# Altium project ANTS-PCU-B1.PrjPcb (part 1 of 2)
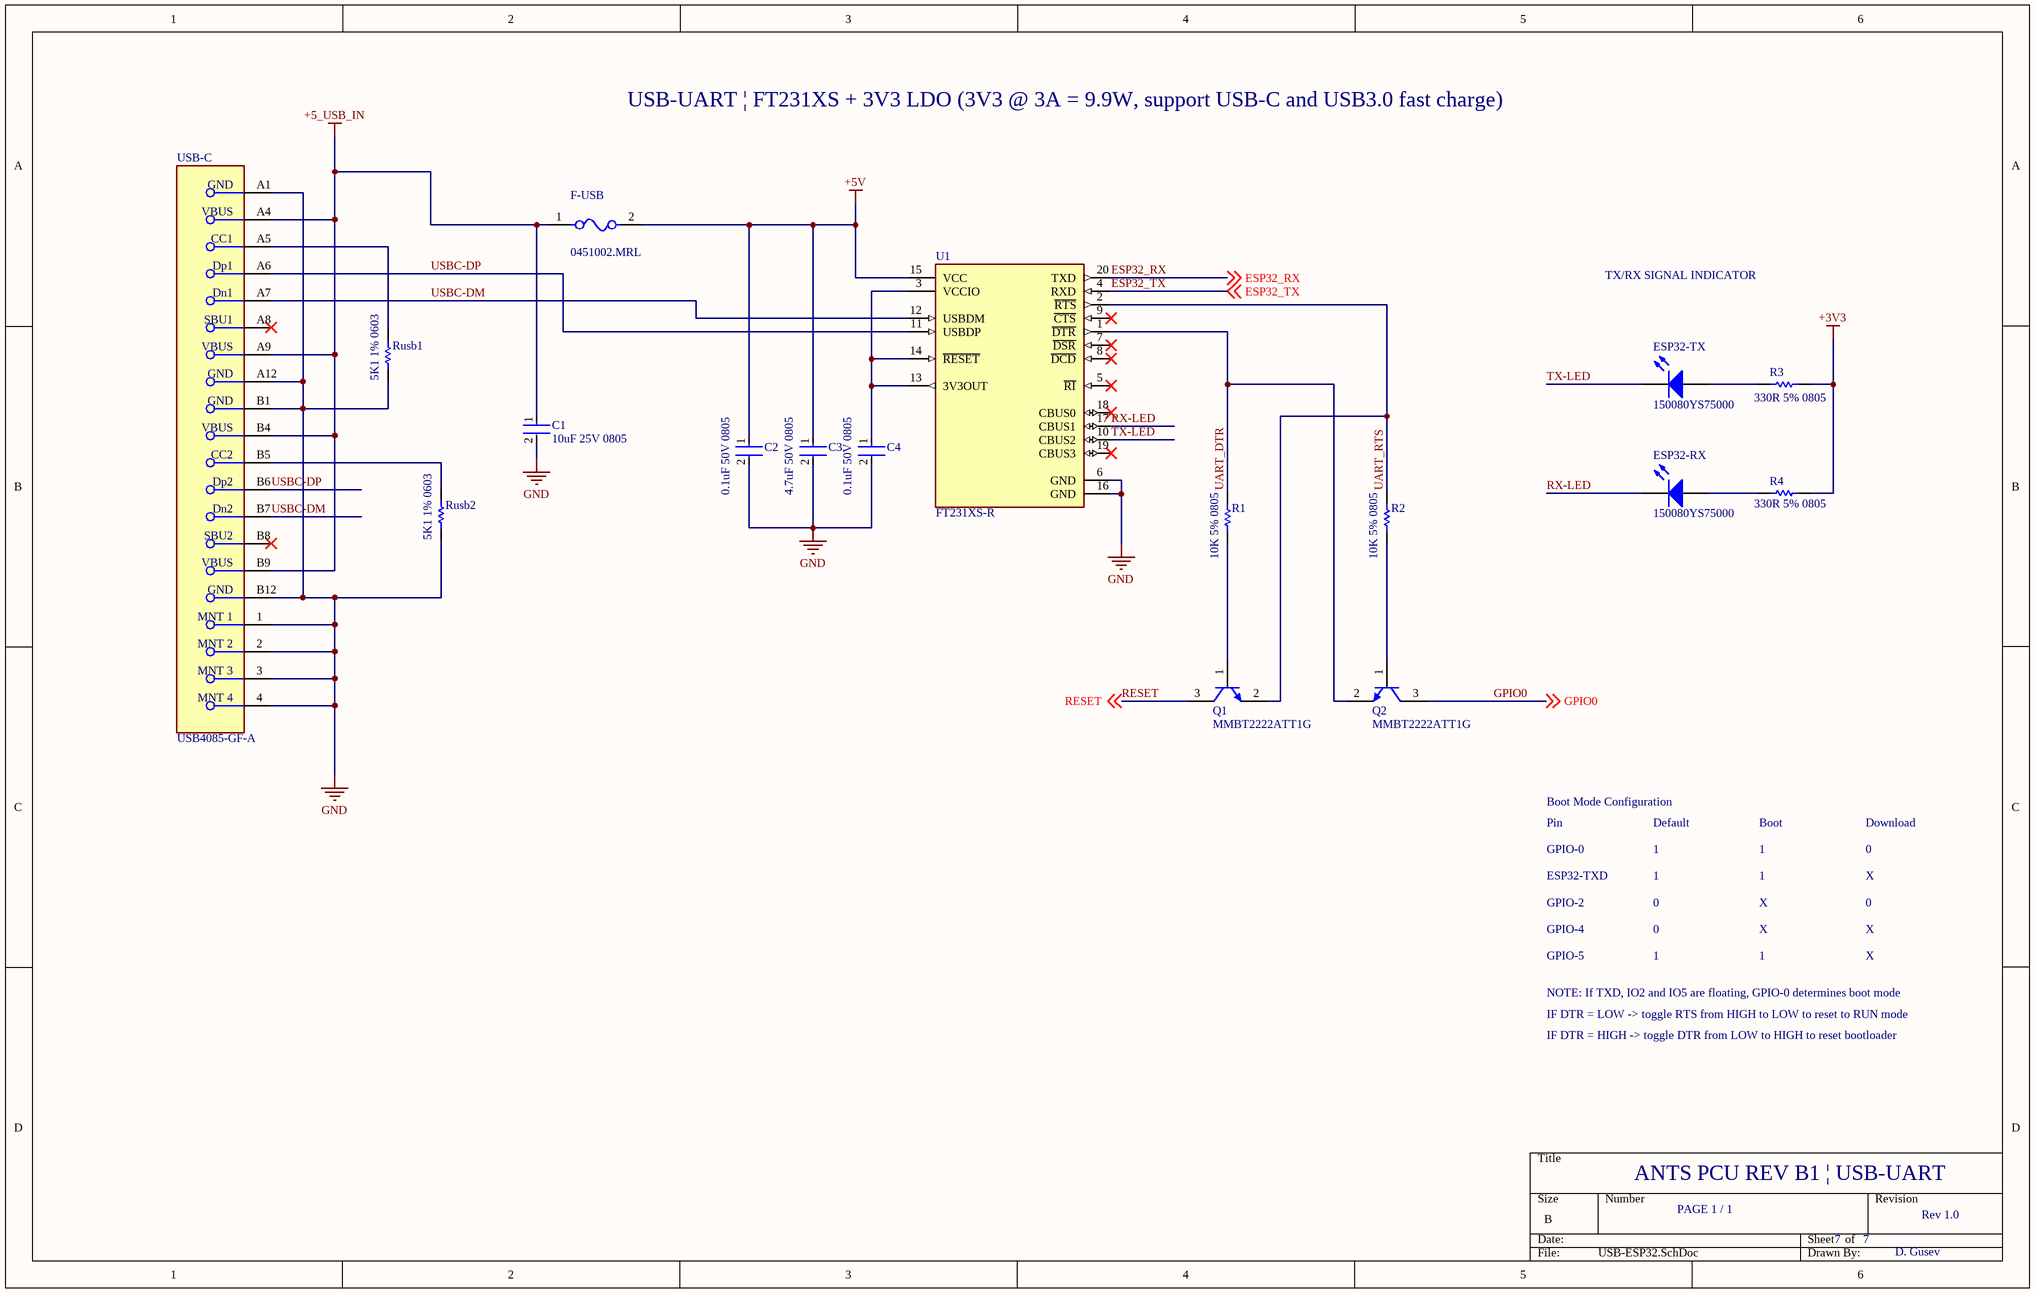
[diagram p0: USB-ESP32.SchDoc]
12 sheets, 182 parts. Net scope: global (net labels, ports and power ports of the same name join across sheets).
Board file: ANTS-PCU-B1.PCBDOC
Sheets:
  USB-ESP32.SchDoc
  ESP32.SchDoc
  ESP32-POWER.SchDoc
  Ethernet.SchDoc
  BATTERY-CONTROL.SchDoc
  POWER_RAIL_CTRL.SchDoc
  POWER_RAIL_MONITORING.SchDoc
  19V-PC-POWER.SchDoc
  12V-EXTRA-POWER.SchDoc
  +5V_3V3_DIGITAL.SchDoc
  RELAYS.SchDoc
  CONN.SchDoc

## Sheet USB-ESP32.SchDoc
size B

### Parts
(Parts that share a designator on the sheet are numbered #1, #2 ... from top to bottom, then left to right.)
C1#1  10uF 25V 0805  [FP-GRM21B-0_15-IPC_C]
C2#1  0.1uF 50V 0805  [FP-C0805C-DN-MFG]
C3#1  4.7uF 50V 0805  [FP-C2012-125-MFG]
C4#1  0.1uF 50V 0805  [FP-C0805C-DN-MFG]
ESP32-RX  150080YS75000  [0805_A]
ESP32-TX  150080YS75000  [0805_A]
F-USB  0451002.MRL  [FP-0451-MFG]
Q1  MMBT2222ATT1G  [ONSC-SC-75-3-463-01_V]
Q2  MMBT2222ATT1G  [ONSC-SC-75-3-463-01_V]
R1#1  10K 5% 0805  [RESC2013X60X40ML20T25]
R2#1  10K 5% 0805  [RESC2013X60X40ML20T25]
R3#1  330R 5% 0805  [RESC2013X60X40ML20T25]
R4#1  330R 5% 0805  [RESC2013X60X40ML20T25]
Rusb1  5K1 1% 0603  [RESC1608X55X25ML10T15]
Rusb2  5K1 1% 0603  [RESC1608X55X25ML10T15]
U1  FT231XS-R  [FP-SSOP-20-MFG]
USB-C  USB4085-GF-A  [FP-USB4085-GF-A-MFG]

### Nets
+3V3: R3#1.1 R4#1.1
+5_USB_IN: C1#1.1 F-USB.1 USB-C.A4(VBUS) USB-C.A9(VBUS) USB-C.B4(VBUS) USB-C.B9(VBUS)
+5V: C2#1.1 C3#1.1 F-USB.2 U1.15(VCC)
GND: C1#1.2 C2#1.2 C3#1.2 C4#1.2 Rusb1.1 Rusb2.1 U1.6(GND) U1.16(GND) USB-C.1(MNT_1) USB-C.2(MNT_2) USB-C.3(MNT_3) USB-C.4(MNT_4) USB-C.A1(GND) USB-C.A12(GND) USB-C.B1(GND) USB-C.B12(GND)
ESP32_RX: U1.20(TXD) ; off-sheet ESP32_RX
ESP32_TX: U1.4(RXD) ; off-sheet ESP32_TX
GPIO0: Q2.3(C) ; off-sheet GPIO0
RESET: Q1.3(C) ; off-sheet RESET
RX-LED: ESP32-RX.1(K) U1.17(CBUS1)
TX-LED: ESP32-TX.1(K) U1.10(CBUS2)
UART_DTR: Q2.2(E) R1#1.2 U1.1(~{DTR})
UART_RTS: Q1.2(E) R2#1.2 U1.2(~{RTS})
USBC-DM: U1.12(USBDM) USB-C.A7(Dn1) USB-C.B7(Dn2)
USBC-DP: U1.11(USBDP) USB-C.A6(Dp1) USB-C.B6(Dp2)
NetC4#1_1: C4#1.1 U1.3(VCCIO) U1.13(3V3OUT) U1.14(~{RESET})
NetESP32-RX_2: ESP32-RX.2(A) R4#1.2
NetESP32-TX_2: ESP32-TX.2(A) R3#1.2
NetQ1_1: Q1.1(B) R1#1.1
NetQ2_1: Q2.1(B) R2#1.1
NetRusb1_2: Rusb1.2 USB-C.A5(CC1)
NetRusb2_2: Rusb2.2 USB-C.B5(CC2)

Not connected (* = marked no-connect by the designer): U1 5(~{RI})* 7(~{DSR})* 8(~{DCD})* 9(~{CTS})* 18(CBUS0)* 19(CBUS3)*; USB-C A8(SBU1)* B8(SBU2)*

### Notes on the sheet
- USB-UART | FT231XS + 3V3 LDO (3V3 @ 3A = 9.9W, support USB-C and USB3.0 fast charge)
- TX/RX SIGNAL INDICATOR
- Boot Mode Configuration
- Pin
- Default
- Boot
- Download
- GPIO-0
- ESP32-TXD
- GPIO-2
- 1
- 0
- X
- GPIO-4
- GPIO-5
- NOTE: If TXD, IO2 and IO5 are floating, GPIO-0 determines boot mode
- IF DTR = LOW -> toggle RTS from HIGH to LOW to reset to RUN mode
- IF DTR = HIGH -> toggle DTR from LOW to HIGH to reset bootloader
- ANTS PCU REV B1 | USB-UART
- PAGE 1 / 1
- 7
- Rev 1.0
- D. Gusev

### Library data of the parts
C1#1 = CMP-2007-03541-2: Chip Multilayer Ceramic Capacitors for General Purpose, 0805, 10uF, X5R, 15%, 10%, 25V; Length: 2mm; Depth: 1.25mm; Termination: SMD/SMT; Voltage: 25V; Height: 1.25mm; Material: Ceramic; Thickness: 0.053inch; Radiation Hardening: No; Min Operating Temperature: -55°C; Width: 0.049inch; Package Quantity: 1; Mount: Surface Mount; Dielectric: X5R; Packaging: Tape and Reel; Capacitance: 10uF; Voltage Rating (DC): 25V; Lead Free: Lead Free; Max Operating Temperature: 85°C; Case Code (Imperial): 0805; Case/Package: 0805; Tolerance: 10%; Voltage Rating: 25V; Case Code (Metric): 2012
C2#1 C4#1 = CMP-2007-00279-2: CAP CER 0.1UF 50V X7R 0805; Manufacturer Part Number: C0805C104K5RACTU; Manufacturer: KEMET; Value: 0.10 μF; Tolerance: 0.1; Temperature Coefficient: 30ppm/°C; Material: Ceramic; Device Class L2: Capacitors; Temperature Range Low: -55°C; Voltage Rating: 50 V; Digikey Description: CAP CER 0.1UF 50V X7R 0805; Category: Cap; ComponentLink2Description: Datasheet; Octopart: https://octopart.com/c0805c104k5ractu-kemet-143926; RoHS: TRUE; ComponentLink2URL: https://content.kemet.com/datasheets/KEM_C1003_C0G_SMD.pdf; Temperature Characteristic: X7R; Temperature: -55°C to +125°C; Height: 0.88mm; Temperature Range High: +125°C; Device Class L1: Passive Components; Automotive: No; Lead Free: Yes; Ipc Land Pattern Name: CAPC200125X78; Device Class L3: Ceramic Capacitors; Mouser Description: Cap Ceramic 0.1uF 50V X7R 10% SMD 2.0 x 1.2 mm 125 C Paper T/R; Capacitance: 0.10 μF; Package: C0805C-DN
C3#1 = CMP-08246-000007-1: CAP CER 4.7UF 50V X5R 0805; Manufacturer Part Number: C2012X5R1H475K125AB; Manufacturer: TDK Corporation; Tolerance: 10%; Temperature Coefficient: 15%; Material: Ceramic; Mouser Description: Multilayer Ceramic Capacitors MLCC - SMD/SMT 0805 4.7uF 50volts X5R 10%; Category: Cap; Temperature Range High: +85°C; Digikey Description: CAP CER 4.7UF 50V X5R 0805; Voltage Rating: 50V; Device Class L1: Passive Components; Temperature Range Low: -55°C; Lead Free: Yes; ComponentLink2Description: Datasheet; Capacitance: 4.7uF; Octopart: https://octopart.com/c2012x5r1h475k125ab-tdk-25947720; Device Class L2: Capacitors; Value: 4.7uF; Temperature: -55°C to +85°C; ComponentLink2URL: https://product.tdk.com/info/en/catalog/datasheets/mlcc_commercial_general_en.pdf; RoHS: TRUE; Height: 1.45mm; Temperature Characteristic: X5R; Package: C2012-125; Device Class L3: Ceramic Capacitors; Automotive: No
ESP32-RX ESP32-TX = CMP-1426-00012-1: SMD mono-color Chip LED, WL-SMCW, Yellow; Manufacturer: Wuerth Elektronik; Color: Yellow; ComponentLink1URL: http://www.we-online.com; PackageReference: 0805_A; ComponentLink2URL: http://katalog.we-online.com/led/datasheet/150080YS75000.pdf; ComponentLink1Description: Manufacturer URL; ComponentLink2Description: Datasheet; PartNumber: 150080YS75000
F-USB = CMP-08605-000053-1: FUSE BOARD MNT 2A 125VAC/VDC SMD; Manufacturer: Littelfuse; Max Fuse Dc Voltage: 125V; Value: 0.0367Ω; Fuse Interrupt Ac Current: 50A; Fuse I2T: 0.53A2Sec; Fuse Blow Speed: Fast; Device Class L2: Fuses; Temperature Range High: +125°C; Category: Fuse; ComponentLink2URL: https://www.littelfuse.com/~/media/electronics/datasheets/fuses/littelfuse_fuse_451_453_datasheet.pdf.pdf; Automotive: No; Temperature Range Low: -55°C; Voltage Rating: 125V; ComponentLink2Description: Datasheet; Temperature: -55°C to +125°C; Device Class L3: unset; Height: 2.94mm; Lead Free: Yes; Resistance: 0.0367Ω; Max Fuse Ac Voltage: 125V; Fuse Interrupt Dc Current: 50A; RoHS: TRUE; Fuse Current: 2A; Digikey Description: FUSE BOARD MNT 2A 125VAC/VDC SMD; Device Class L1: Circuit Protection; Octopart: https://octopart.com/0451002.mrl-littelfuse-566376; Mouser Description: Surface Mount Fuses 125V 2A; Package: 0451; Manufacturer Part Number: 0451002.MRL
Q1 Q2 = CMP-1048-00417-1: General Purpose Transistor, NPN Silicon, 3-Pin SC-75, Pb-Free, Tape and Reel; Manufacturer: On Semiconductor; IC Continuous (A): 0.6; fT Min (MHz): 300; DatasheetVersion: Rev. 5; PackageVersion: Rev. F, 07/2005; ComponentLink1Description: Manufacturer URL; RoHS: TRUE; Packing: Tape and Reel; ComponentLink3URL: http://www.onsemi.com/pub_link/Collateral/463-01.PDF; ComponentLink1URL: http://www.onsemi.com/; ComponentLink3Description: Package Specification; ComponentLink2URL: http://www.onsemi.cn/pub_link/Collateral/MMBT2222ATT1-D.PDF; Mounting Technology: Surface Mount; PartNumber: MMBT2222ATT1G; ComponentLink2Description: Datasheet; Polarity: NPN; PackageReference: SC-75-3-463-01; PackageDescription: 3-Pin Small Outline Transistor, Body 1.6 x 0.8 mm, Pitch 0.5 mm
R1#1 R2#1 R3#1 R4#1 = CMP-2001-00590-1: Part Number: ERA6AEB123V; Manufacturer: Panasonic
Rusb1 Rusb2 = CMP-2000-04091-1: Manufacturer: Yageo; Part Number: RC0603FR-075K1L
U1 = CMP-0248-00024-3: IC USB SERIAL FULL UART 20SSOP; Operating Supply Voltage: 5V; Operating Supply Current: 8mA; Number of Channels: 1; Min Supply Voltage: 2.97V; Max Supply Voltage: 5.5V; Data Rate: 12Mbps; Height: 0.059inch; Packaging: Tape and Reel; Mount: Surface Mount; Package Quantity: 2000; Radiation Hardening: No; Case/Package: SSOP; Min Operating Temperature: -40°C; Width: 0.157inch; Number of Pins: 20; Weight: 0.016oz; Interface: UART; Max Operating Temperature: 85°C; Length: 8.74mm
USB-C = CMP-196119-000001-1: CONN RCPT USB2.0 TYPEC 16POS; Manufacturer: Global Connector Technology; Voltage Rating: 20V; Conn Orientation: Right Angle; Shielding: true; Current Rating: 4.25A; Number Of Contacts: 16; Pitch: 0.85mm; Is Female: yes; ComponentLink2URL: https://gct.co/files/drawings/usb4085.pdf; Category: Conn; Automotive: No; ComponentLink2Description: Datasheet; Height: 3.66mm; Manufacturer Part Number: USB4085-GF-A; Package: 0; Usb Standard: USB 2.0; Octopart: https://octopart.com/usb4085-gf-a-global+connector+technology-94773699; Device Class L3: unset; Digikey Description: CONN RCPT USB2.0 TYPEC 16POS; Temperature Range Low: -40°C; Temperature: -40°C to +85°C; Lead Free: Yes; Contact Material: Gold,Nickel; Device Class L1: Connectors; Temperature Range High: +85°C; Device Class L2: USB Connectors; RoHS: TRUE

## Sheet ESP32.SchDoc
size B
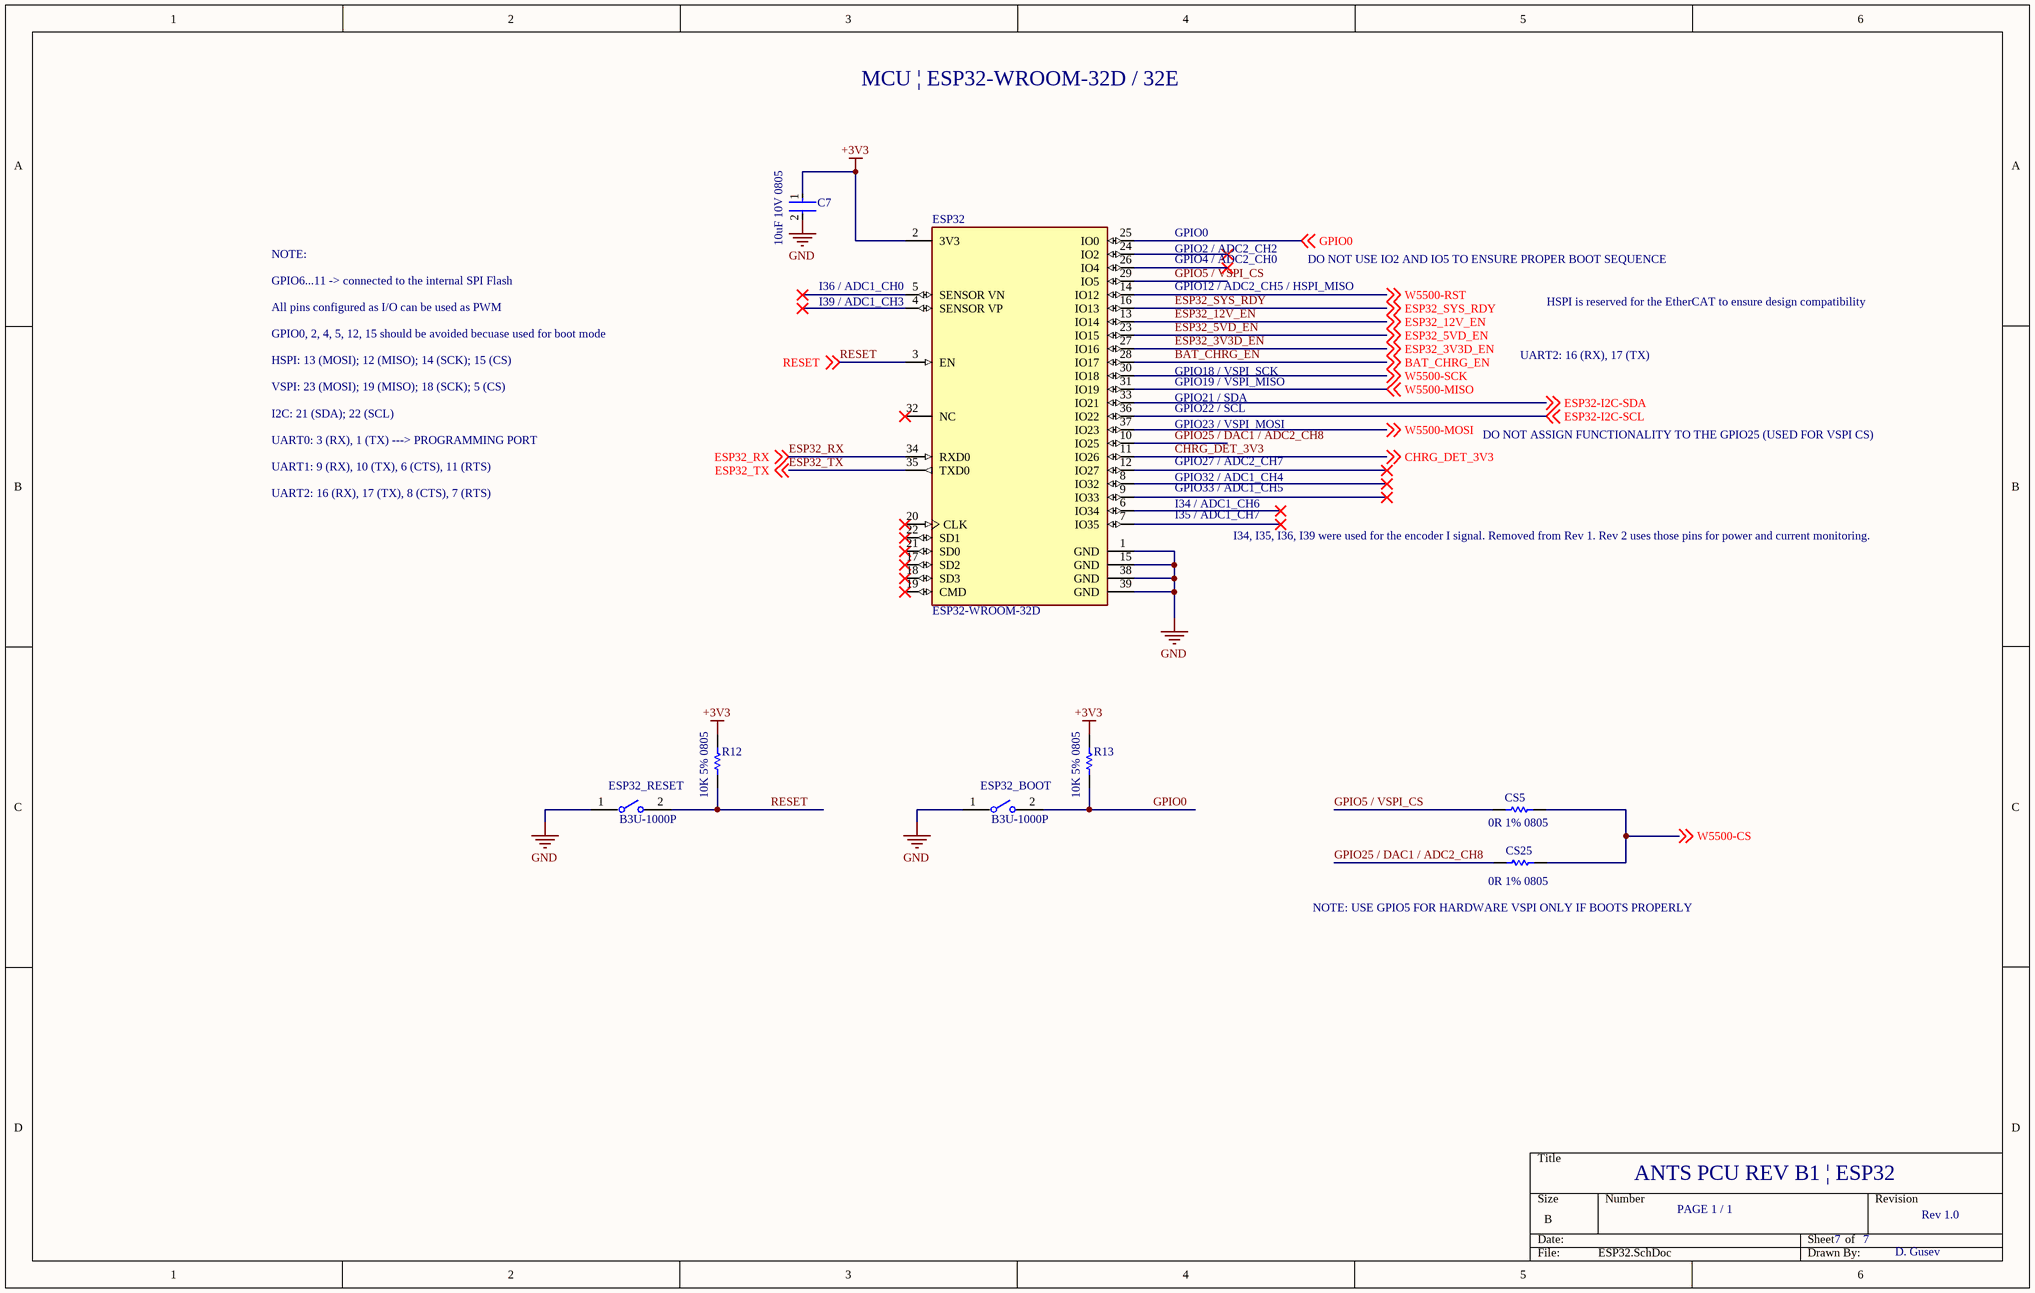
[diagram p1: ESP32.SchDoc]

### Parts
C7  10uF 10V 0805  [FP-C0805C-DG-MFG]
CS5  0R 1% 0805  [RESC2013X60X35LL10T20]
CS25  0R 1% 0805  [RESC2013X60X35LL10T20]
ESP32  ESP32-WROOM-32D  [FP-ESP32-WROOM-32D-MFG]
ESP32_BOOT  B3U-1000P  [FP-B3U-1000P-MFG]
ESP32_RESET  B3U-1000P  [FP-B3U-1000P-MFG]
R12  10K 5% 0805  [RESC2013X60X40ML20T25]
R13  10K 5% 0805  [RESC2013X60X40ML20T25]

### Nets
+3V3: C7.1 ESP32.2(3V3) R12.2 R13.2
GND: C7.2 ESP32.1(GND) ESP32.15(GND) ESP32.38(GND) ESP32.39(GND) ESP32_BOOT.1 ESP32_RESET.1
BAT_CHRG_EN: ESP32.28(IO17) ; off-sheet BAT_CHRG_EN
CHRG_DET_3V3: ESP32.11(IO26) ; off-sheet CHRG_DET_3V3
ESP32-I2C-SCL: ESP32.36(IO22) ; off-sheet ESP32-I2C-SCL
ESP32-I2C-SDA: ESP32.33(IO21) ; off-sheet ESP32-I2C-SDA
ESP32_3V3D_EN: ESP32.27(IO16) ; off-sheet ESP32_3V3D_EN
ESP32_5VD_EN: ESP32.23(IO15) ; off-sheet ESP32_5VD_EN
ESP32_12V_EN: ESP32.13(IO14) ; off-sheet ESP32_12V_EN
ESP32_RX: ESP32.34(RXD0) ; off-sheet ESP32_RX
ESP32_SYS_RDY: ESP32.16(IO13) ; off-sheet ESP32_SYS_RDY
ESP32_TX: ESP32.35(TXD0) ; off-sheet ESP32_TX
GPIO0: ESP32.25(IO0) ESP32_BOOT.2 R13.1 ; off-sheet GPIO0
GPIO5 / VSPI_CS: CS5.1 ESP32.29(IO5)
GPIO25 / DAC1 / ADC2_CH8: CS25.1 ESP32.10(IO25)
RESET: ESP32.3(EN) ESP32_RESET.2 R12.1 ; off-sheet RESET
W5500-CS: CS5.2 CS25.2 ; off-sheet W5500-CS
W5500-MISO: ESP32.31(IO19) ; off-sheet W5500-MISO
W5500-MOSI: ESP32.37(IO23) ; off-sheet W5500-MOSI
W5500-RST: ESP32.14(IO12) ; off-sheet W5500-RST
W5500-SCK: ESP32.30(IO18) ; off-sheet W5500-SCK

Not connected (* = marked no-connect by the designer): ESP32 4(SENSOR_VP)* 5(SENSOR_VN)* 6(IO34)* 7(IO35)* 8(IO32)* 9(IO33)* 12(IO27)* 17(SD2)* 18(SD3)* 19(CMD)* 20(CLK)* 21(SD0)* 22(SD1)* 24(IO2)* 26(IO4)* 32(NC)*

### Notes on the sheet
- MCU | ESP32-WROOM-32D / 32E
- GPIO0
- NOTE:
- GPIO6...11 -> connected to the internal SPI Flash
- (near ESP32) I36 / ADC1_CH0
- GPIO2 / ADC2_CH2
- GPIO4 / ADC2_CH0
- GPIO12 / ADC2_CH5 / HSPI_MISO
- DO NOT USE IO2 AND IO5 TO ENSURE PROPER BOOT SEQUENCE
- All pins configured as I/O can be used as PWM
- GPIO0, 2, 4, 5, 12, 15 should be avoided becuase used for boot mode
- HSPI: 13 (MOSI); 12 (MISO); 14 (SCK); 15 (CS)
- (near ESP32) I39 / ADC1_CH3
- UART2: 16 (RX), 17 (TX)
- HSPI is reserved for the EtherCAT to ensure design compatibility
- VSPI: 23 (MOSI); 19 (MISO); 18 (SCK); 5 (CS)
- I2C: 21 (SDA); 22 (SCL)
- GPIO18 / VSPI_SCK
- GPIO19 / VSPI_MISO
- GPIO21 / SDA
- GPIO22 / SCL
- GPIO23 / VSPI_MOSI
- DO NOT ASSIGN FUNCTIONALITY TO THE GPIO25 (USED FOR VSPI CS)
- UART0: 3 (RX), 1 (TX) ---> PROGRAMMING PORT
- UART1: 9 (RX), 10 (TX), 6 (CTS), 11 (RTS)
- UART2: 16 (RX), 17 (TX), 8 (CTS), 7 (RTS)
- GPIO27 / ADC2_CH7
- GPIO32 / ADC1_CH4
- GPIO33 / ADC1_CH5
- I34 / ADC1_CH6
- I35 / ADC1_CH7
- I34, I35, I36, I39 were used for the encoder I signal. Removed from Rev 1. Rev 2 uses those pins for power and current monitoring.
- (near CS25) NOTE: USE GPIO5 FOR HARDWARE VSPI ONLY IF BOOTS PROPERLY
- ANTS PCU REV B1 | ESP32
- PAGE 1 / 1
- 7
- Rev 1.0
- D. Gusev

### Library data of the parts
C7 = CMP-2007-03243-2: CAP CER 10UF 10V X5R 0805; Manufacturer Part Number: C0805C106K8PACTU; Manufacturer: Kemet; 3DS Part Number: 220-00001; Tolerance: 10%; Temperature Coefficient: 15%; Material: Ceramic; Device Class L2: Capacitors; Device Class L1: Passive Components; ComponentLink2URL: https://content.kemet.com/datasheets/KEM_C1006_X5R_SMD.pdf; Height: 1.4mm; Lead Free: Yes; Digikey Description: CAP CER 10UF 10V X5R 0805; Octopart: https://octopart.com/c0805c106k8pactu-kemet-98697; Capacitance: 10uF; Value: 10uF; Temperature Range Low: -55°C; Temperature: -55°C to +85°C; Automotive: No; Mouser Description: CAP CER 10UF 10V X5R 0805; Ipc Land Pattern Name: CAPC200125X125; Temperature Range High: +85°C; Voltage: 10V; RoHS: TRUE; Device Class L3: Ceramic Capacitors; ComponentLink2Description: Datasheet; Voltage Rating: 10V; Package: C0805C-DG; Temperature Characteristic: X5R; Category: Cap
CS5 CS25 = CMP-1659-00014-4: Chip Resistor, 1 Ohm, +/- 1%, 125 mW, -55 to 155 degC, 0805 (2012 Metric), RoHS, Tape and Reel; Manufacturer: Yageo; Voltage Rating: 150 V; REACH SVHC: No SVHC; Mounting Technology: Surface Mount; RoHSCompliant: true; Packaging: Tape and Reel; ComponentLink2URL: http://www.yageo.com/documents/recent/PYu-RC_Group_51_RoHS_L_04.pdf; Pins: 2; Package Quantity: 5000; DatasheetVersion: Rev. 4, 02/2016; Mount: Surface Mount; Max Operating Temperature: 155 degC; PackageDescription: 2-Pin Surface Mounted Device, Body 2 x 1.25 mm; PackageReference: 0805; Length: 2 mm; Min Operating Temperature: -55 degC; ComponentLink1URL: http://www.yageo.com/; Height: 0.5 mm; ComponentLink1Description: Manufacturer URL; ComponentLink2Description: Datasheet
ESP32 = CMP-194065-000003-1: WIFI MODULE 32MBITS SPI FLASH; Manufacturer: Espressif Systems; Max Supply Voltage: 3.6V; Nominal Supply Current: 500mA; Max Frequency: 2484MHz; Number Of Adc Channels: 16; Number Of Gpio: 32; Interface: I2C,SPI,UART,Ethernet,I2S,Other; Data Rate: 150Mbits/s; Min Supply Voltage: 3V; Bandwidth: 72MHz; Sensitivity: -98dBm; Octopart: https://octopart.com/esp32-wroom-32d-espressif+systems-91040050; Package: ESP32-WROOM-32D; ComponentLink2URL: https://www.espressif.com/sites/default/files/documentation/esp32-wroom-32d_esp32-wroom-32u_datasheet_en.pdf; Lead Free: Yes; Category: UNK; Mouser Description: Wi-Fi/BT BLE Module ESP32-D0WD, SPI Flash, UART, P; Device Class L1: Integrated Circuits (ICs); RoHS: TRUE; Temperature Range Low: -40°C; ComponentLink2Description: Datasheet; Digikey Description: WIFI MODULE 32MBITS SPI FLASH; Height: 3.2mm; Temperature: -40°C to +85°C; Manufacturer Part Number: ESP32-WROOM-32D; Device Class L3: Transceivers; Device Class L2: RF Semiconductors and Devices; Temperature Range High: +85°C; Automotive: No
ESP32_BOOT ESP32_RESET = CMP-2100-03586-2: SWITCH TACTILE SPST-NO 0.05A 12V; Contact Resistance: 100mR; Operating Force: 1.5N; Max Current Rating: 50mA; Switch Travel: 0.15mm; Actuator Type: Standard; Mechanical Life: 200000Cycles; Ratings: Dust Proof; Illumination Type: Non-Illuminated; Throw Configuration: SPST; Actuator Length: 0.4mm; Switch Function: Off-Mom; Height: 1.2mm; Width: 3mm; Weight: 0.000776oz; Contact Material: Silver; Max Voltage Rating (DC): 12V; Insulation Resistance: 100MR; Lead Free: Lead Free; Current Rating: 50mA; Termination: SMD/SMT; Length: 4mm; Voltage Rating (DC): 12V; Contact Current Rating: 50mA; Orientation: Straight; Depth: 2.5mm; Max Operating Temperature: 70°C; Packaging: Tape and Reel; Min Operating Temperature: -25°C; Package Quantity: 1; Mount: Surface Mount; Electrical Life: 200000Cycles
R12 R13 = CMP-2001-00590-1: as R1#1 on sheet USB-ESP32

## Sheet ESP32-POWER.SchDoc
size B
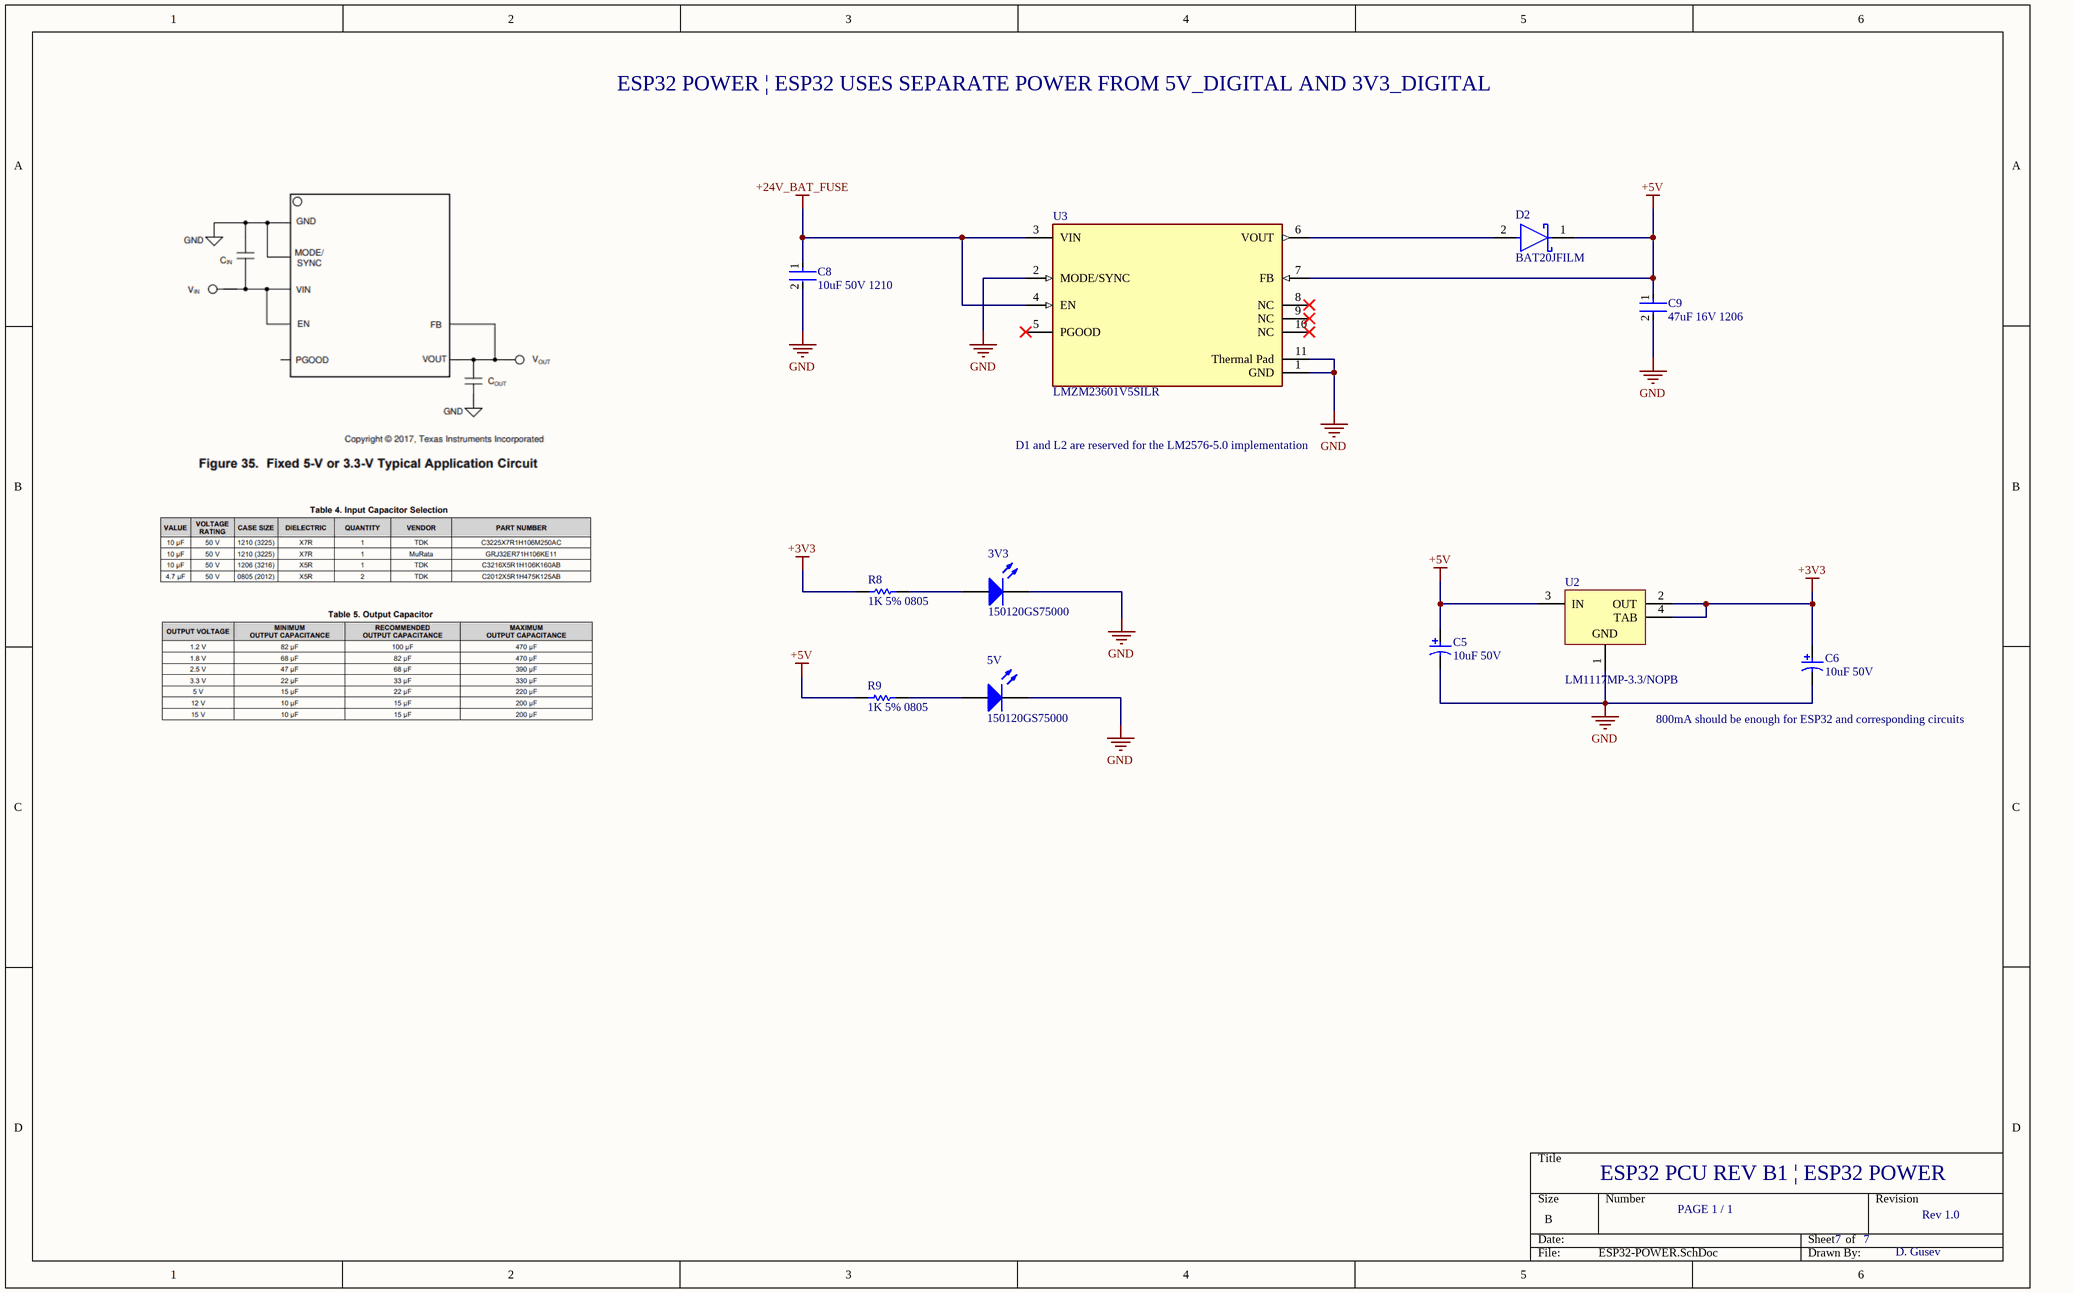
[diagram p2: ESP32-POWER.SchDoc]

### Parts
(Parts that share a designator on the sheet are numbered #1, #2 ... from top to bottom, then left to right.)
3V3  150120GS75000  [1206_A]
5V  150120GS75000  [1206_A]
C5  10uF 50V  [PNSC-FK-V-D_V]
C6  10uF 50V  [PNSC-FK-V-D_V]
C8  10uF 50V 1210  [FP-C3225-250-0_4-MFG]
C9  47uF 16V 1206  [FP-C3216-160-0_2-MFG]
D2  BAT20JFILM  [FP-BAT20JFILM-MFG]
R8#1  1K 5% 0805  [RESC2013X60X40ML20T25]
R9  1K 5% 0805  [RESC2013X60X40ML20T25]
U2  LM1117MP-3.3/NOPB  [DCY0004A_L]
U3  LMZM23601V5SILR  [LMZM23601V5SILR]

### Nets
+3V3: C6.1 R8#1.2 U2.2(OUT) U2.4(TAB)
+5V: C5.1 C9.1 D2.1(K) R9.2 U2.3(IN) U3.7(FB)
+24V_BAT_FUSE: C8.1 U3.3(VIN) U3.4(EN)
GND: 3V3.1(K) 5V.1(K) C5.2 C6.2 C8.2 C9.2 U2.1(GND) U3.1(GND) U3.2(MODE/SYNC) U3.11(Thermal_Pad)
Net3V3_2: 3V3.2(A) R8#1.1
Net5V_2: 5V.2(A) R9.1
NetD2_2: D2.2(A) U3.6(VOUT)

Not connected (* = marked no-connect by the designer): U3 5(PGOOD)* 8(NC)* 9(NC)* 10(NC)*

### Notes on the sheet
- ESP32 POWER | ESP32 USES SEPARATE POWER FROM 5V_DIGITAL AND 3V3_DIGITAL
- D1 and L2 are reserved for the LM2576-5.0 implementation
- (near C6) 800mA should be enough for ESP32 and corresponding circuits
- ESP32 PCU REV B1 | ESP32 POWER
- PAGE 1 / 1
- 7
- Rev 1.0
- D. Gusev

### Library data of the parts
3V3 5V = CMP-1426-00014-1: SMD mono-color Chip LED, WL-SMCW, Green; Manufacturer: Wuerth Elektronik; PackageReference: 1206_A; PartNumber: 150120GS75000; ComponentLink1Description: Manufacturer URL; ComponentLink2URL: http://katalog.we-online.com/led/datasheet/150120GS75000.pdf; ComponentLink2Description: Datasheet; Color: Green; ComponentLink1URL: http://www.we-online.com
C5 C6 = CMP-2000-06207-1: Aluminum Electrolytic Capacitor, 10 uF, +/- 20%, 50 V, 2-Pin SMD (Size Code D), -55 to 105 degC, RoHS, Tape and Reel; Manufacturer: Panasonic; Lifetime@Temperature: 2000Hrs@105°C; Type: Can; Ripple Current: 165mA; Impedance: 0.88O; Capacitance: 10µF; Manufacturer URL: http://www.panasonic.com/; Mounting Technology: SurfaceMount; Rated Voltage: 50V; Datasheet URL: http://industrial.panasonic.com/cdbs/www-data/pdf/RDE0000/ABA0000C1181.pdf; Package Reference: FK-V-D; Series: FK; Operating Temp Range: -55to+105°C; Operating Temp-Max: 105°C; Datasheet Version: 03/2016; Package URL: http://industrial.panasonic.com/cdbs/www-data/pdf/RDE0000/DME0000COL48.pdf; Case Size/Dimension: Ø6.3x5.8mm; Package Description: 2-Pin Electrolytic Aluminum Capacitor, Body 6.6 x 6.6 mm
C8 = CMP-08246-002653-1: Multilayer Ceramic Capacitors 10uF ±20% 50V X7R SMD 1210; Width: 0.098inch; Package Quantity: 1000; Height: 2.5mm; Dielectric Material: Ceramic; Voltage Rating: 50V; Series: C; Capacitance: 10uF; Tolerance: 20%; Weight: 0.000564oz; Case/Package: 1210; Case Code (Imperial): 1210; Dielectric: X7R; Case Code (Metric): 3225; REACH SVHC: No SVHC; Packaging: Tape and Reel; Length: 0.126inch; Termination: SMD/SMT; Min Operating Temperature: -55°C; Voltage Rating (DC): 50V; Lead Free: Lead Free; Max Operating Temperature: 125°C; Thickness: 0.11inch; Mount: Surface Mount
C9 = CMP-2000-07442-2: Multilayer Ceramic Capacitors 47uF ±20% 16V X5R SMD 1206; Resistor Type: Ceramic; Width: 0.063inch; Case Code (Imperial): 1206; Radiation Hardening: No; Thickness: 0.071inch; Dielectric: X5R; Weight: 0.000571oz; Termination: SMD/SMT; Dielectric Material: Ceramic; Min Operating Temperature: -55°C; Depth: 1.6mm; Case Code (Metric): 3216; Max Operating Temperature: 85°C; RoHS Compliant: Yes; REACH SVHC: No SVHC; Mount: Surface Mount; Lead Free: Lead Free; Height: 1.6mm; Length: 3.2mm; Tolerance: 20%; Voltage Rating (DC): 16V; Capacitance: 47uF; Package Quantity: 1; Construction: Flat; Packaging: Tape and Reel; Series: C; Case/Package: 1206; Voltage Rating: 16V
D2 = CMP-12187-000030-1: DIODE SCHOTTKY 23V 1A SOD323; Polarity: Standard; Element Configuration: Single; Capacitance: 30pF; Forward Voltage: 620mV; Max Surge Current: 5A; Peak Reverse Current: 12uA; Packaging: Tape and Reel; Weight: 0.01lb; Output Current: 1A; Lead Free: Lead Free; Forward Current: 1A; Mount: Surface Mount; Max Reverse Voltage (DC): 23V; Average Rectified Current: 1A; Max Operating Temperature: 150°C; Max Forward Surge Current (Ifsm): 5A; REACH SVHC: No SVHC; Current Rating: 1A; Length: 1.8mm; Radiation Hardening: No; Max Reverse Leakage Current: 12uA; Voltage Rating (DC): 23V; Height: 1.03mm; Peak Non-Repetitive Surge Current: 5A; Max Repetitive Reverse Voltage (Vrrm): 23V; Min Operating Temperature: -65°C; Number of Pins: 2; Width: 1.35mm; Package Quantity: 1
R8#1 R9 = CMP-2001-00590-1: as R1#1 on sheet USB-ESP32
U2 = CMP-0062-01638-4: 800mA Low-Dropout Linear Regulator, 4-pin SOT-223, Pb-Free; Manufacturer: Texas Instruments; CompType: LDO IC; PackageTopMarking: XYTT*N05A; High-Reliability: Y; PowerWise: N; ComponentLink1URL: http://www.ti.com/general/docs/lit/getliterature.tsp?genericPartNumber=LM1117-N&fileType=pdf; PinCount: 4; PackageDescription: Molded SOT-223, 6.50 x 3.56 x 1.6mm Body, 4 Lead, 2.3mm Pitch; Code_IPC: SOT223-4; PartNumber: LM1117MP-3.3/NOPB; Code_JEDEC: TO-261-AA; RoHS: Y; PackageReference: DCY0004A; ComponentLink1Description: Datasheet URL
U3 = LMZM23601V5SILR: DC DC CONVERTER 5V; Max Input Voltage: 36V; Efficiency: 87%; Min Input Voltage: 4V; Number of Outputs: 1; Max Output Current: 1A; Packaging: Cut Tape; Max Operating Temperature: 125°C; RoHS Compliant: Yes; Features: UVLO; Voltage - Output 1: 5V; Min Operating Temperature: -40°C; Mount: Surface Mount

## Sheet Ethernet.SchDoc
size B
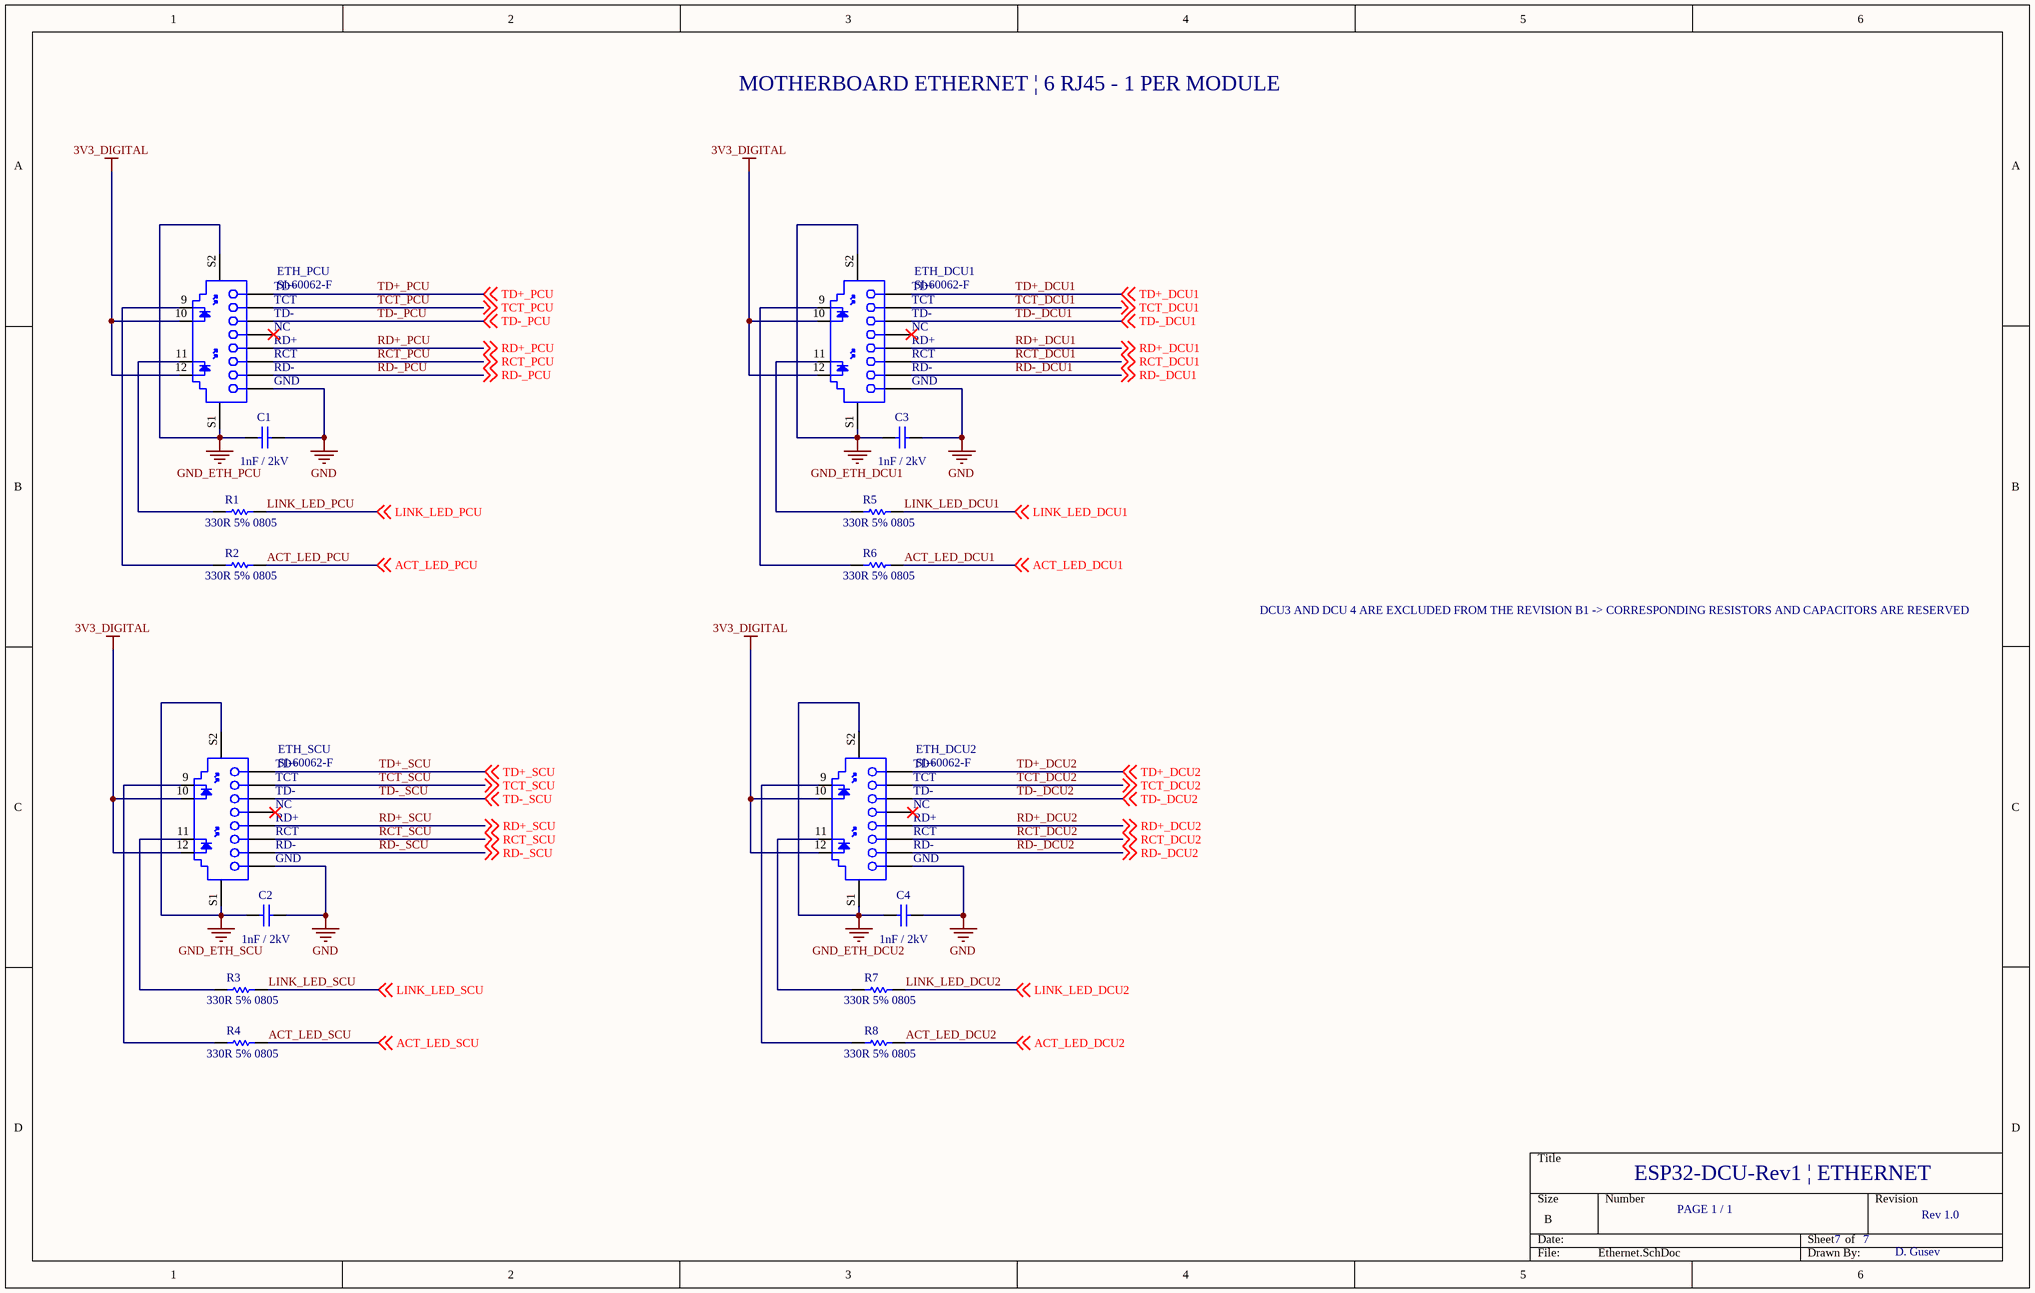
[diagram p3: Ethernet.SchDoc]

### Parts
(Parts that share a designator on the sheet are numbered #1, #2 ... from top to bottom, then left to right.)
C1#2  1nF / 2kV  [CAPC4532X155X60LL30T35]
C2#2  1nF / 2kV  [CAPC4532X155X60LL30T35]
C3#2  1nF / 2kV  [CAPC4532X155X60LL30T35]
C4#2  1nF / 2kV  [CAPC4532X155X60LL30T35]
ETH_DCU1  SI-60062-F  [BELF-SI-60062-F_V]
ETH_DCU2  SI-60062-F  [BELF-SI-60062-F_V]
ETH_PCU  SI-60062-F  [BELF-SI-60062-F_V]
ETH_SCU  SI-60062-F  [BELF-SI-60062-F_V]
R1#2  330R 5% 0805  [RESC2013X60X35LL10T20]
R2#2  330R 5% 0805  [RESC2013X60X35LL10T20]
R3#2  330R 5% 0805  [RESC2013X60X35LL10T20]
R4#2  330R 5% 0805  [RESC2013X60X35LL10T20]
R5  330R 5% 0805  [RESC2013X60X35LL10T20]
R6  330R 5% 0805  [RESC2013X60X35LL10T20]
R7  330R 5% 0805  [RESC2013X60X35LL10T20]
R8#2  330R 5% 0805  [RESC2013X60X35LL10T20]

### Nets
3V3_DIGITAL: ETH_DCU1.10 ETH_DCU1.12 ETH_DCU2.10 ETH_DCU2.12 ETH_PCU.10 ETH_PCU.12 ETH_SCU.10 ETH_SCU.12
GND: C1#2.2 C2#2.2 C3#2.2 C4#2.2 ETH_DCU1.8(GND) ETH_DCU2.8(GND) ETH_PCU.8(GND) ETH_SCU.8(GND)
GND_ETH_DCU1: C3#2.1 ETH_DCU1.S1 ETH_DCU1.S2
GND_ETH_DCU2: C4#2.1 ETH_DCU2.S1 ETH_DCU2.S2
GND_ETH_PCU: C1#2.1 ETH_PCU.S1 ETH_PCU.S2
GND_ETH_SCU: C2#2.1 ETH_SCU.S1 ETH_SCU.S2
ACT_LED_DCU1: R6.2 ; off-sheet ACT_LED_DCU1
ACT_LED_DCU2: R8#2.2 ; off-sheet ACT_LED_DCU2
ACT_LED_PCU: R2#2.2 ; off-sheet ACT_LED_PCU
ACT_LED_SCU: R4#2.2 ; off-sheet ACT_LED_SCU
LINK_LED_DCU1: R5.2 ; off-sheet LINK_LED_DCU1
LINK_LED_DCU2: R7.2 ; off-sheet LINK_LED_DCU2
LINK_LED_PCU: R1#2.2 ; off-sheet LINK_LED_PCU
LINK_LED_SCU: R3#2.2 ; off-sheet LINK_LED_SCU
RCT_DCU1: ETH_DCU1.6(RCT) ; off-sheet RCT_DCU1
RCT_DCU2: ETH_DCU2.6(RCT) ; off-sheet RCT_DCU2
RCT_PCU: ETH_PCU.6(RCT) ; off-sheet RCT_PCU
RCT_SCU: ETH_SCU.6(RCT) ; off-sheet RCT_SCU
RD+_DCU1: ETH_DCU1.5(RD+) ; off-sheet RD+_DCU1
RD+_DCU2: ETH_DCU2.5(RD+) ; off-sheet RD+_DCU2
RD+_PCU: ETH_PCU.5(RD+) ; off-sheet RD+_PCU
RD+_SCU: ETH_SCU.5(RD+) ; off-sheet RD+_SCU
RD-_DCU1: ETH_DCU1.7(RD-) ; off-sheet RD-_DCU1
RD-_DCU2: ETH_DCU2.7(RD-) ; off-sheet RD-_DCU2
RD-_PCU: ETH_PCU.7(RD-) ; off-sheet RD-_PCU
RD-_SCU: ETH_SCU.7(RD-) ; off-sheet RD-_SCU
TCT_DCU1: ETH_DCU1.2(TCT) ; off-sheet TCT_DCU1
TCT_DCU2: ETH_DCU2.2(TCT) ; off-sheet TCT_DCU2
TCT_PCU: ETH_PCU.2(TCT) ; off-sheet TCT_PCU
TCT_SCU: ETH_SCU.2(TCT) ; off-sheet TCT_SCU
TD+_DCU1: ETH_DCU1.1(TD+) ; off-sheet TD+_DCU1
TD+_DCU2: ETH_DCU2.1(TD+) ; off-sheet TD+_DCU2
TD+_PCU: ETH_PCU.1(TD+) ; off-sheet TD+_PCU
TD+_SCU: ETH_SCU.1(TD+) ; off-sheet TD+_SCU
TD-_DCU1: ETH_DCU1.3(TD-) ; off-sheet TD-_DCU1
TD-_DCU2: ETH_DCU2.3(TD-) ; off-sheet TD-_DCU2
TD-_PCU: ETH_PCU.3(TD-) ; off-sheet TD-_PCU
TD-_SCU: ETH_SCU.3(TD-) ; off-sheet TD-_SCU
NetETH_DCU1_9: ETH_DCU1.9 R6.1
NetETH_DCU1_11: ETH_DCU1.11 R5.1
NetETH_DCU2_9: ETH_DCU2.9 R8#2.1
NetETH_DCU2_11: ETH_DCU2.11 R7.1
NetETH_PCU_9: ETH_PCU.9 R2#2.1
NetETH_PCU_11: ETH_PCU.11 R1#2.1
NetETH_SCU_9: ETH_SCU.9 R4#2.1
NetETH_SCU_11: ETH_SCU.11 R3#2.1

Not connected (* = marked no-connect by the designer): ETH_DCU1 4(NC)*; ETH_DCU2 4(NC)*; ETH_PCU 4(NC)*; ETH_SCU 4(NC)*

### Notes on the sheet
- MOTHERBOARD ETHERNET | 6 RJ45 - 1 PER MODULE
- DCU3 AND DCU 4 ARE EXCLUDED FROM THE REVISION B1 -> CORRESPONDING RESISTORS AND CAPACITORS ARE RESERVED
- ESP32-DCU-Rev1 | ETHERNET
- PAGE 1 / 1
- 7
- Rev 1.0
- D. Gusev

### Library data of the parts
C1#2 C2#2 C3#2 C4#2 = CMP-2000-06032-1: Chip Capacitor, 1000 pF, +/- 10%, 2000 V, -55 to 125 degC, 1812 (4532 Metric), RoHS, Tape and Reel; Manufacturer: Kemet; Kits: 399-5086-ND-KITCERHI-VOLTAGECAPS; Catalog Drawings: ACTU_1812; Capacitance: 1000pF; Product Training Modules: CapacitorBasics-TypicalUsesforCapacitors; Online Catalog: X7RDielectricHighVoltage; Other Names: 399-3447-1; Temperature Coefficient: X7R; Voltage - Rated: 2000V(2kV); Family: CeramicCapacitors; Height - Seated (Max): -; Standard Package: 1; Size / Dimension: 0.177"Lx0.126"W(4.50mmx3.20mm); Datasheet URL: http://capacitoredge.kemet.com/capedge2/DataSheet/Datasheet-C1812C102KGRACTU.pdf?pn=C1812C102KGRACTU; Datasheet Version: 09/2016; Thickness (Max): 0.061"(1.55mm); Applications: SMPSFiltering; Package Description: 2-Pin Surface Mount Device, Body 4.5 x 3.2 mm; Package Reference: 1812; Mounting Technology: SurfaceMount; Packaging: CutTape(CT); Manufacturer URL: http://www.kemet.com/; Operating Temperature: -55°C~125°C; Mounting Type: SurfaceMount,MLCC; Features: HighVoltage; Package / Case: 1812(4532Metric); Lead Spacing: -; Tolerance: ±10%; Lead Style: -; Series: C; Category: Capacitors; Ratings: -
ETH_DCU1 ETH_DCU2 ETH_PCU ETH_SCU = CMP-2000-07059-1: 1 Port RJ45 Magjack Connector with Yellow and Green LED, 10/100 Base-T, 12-Pin THD, RoHS, Tray; Manufacturer: Bel Fuse; Number of Ways: 8P4C; Gender: Female; Shield Type: STP; Connector Type: RJ45; Contact Plating: Gold; Mounting Type: ThroughHole; Datasheet Version: Rev. B0, 09/2008; Package Reference: SI-60062-F; Manufacturer URL: http://belfuse.com/; Package Description: 12-Pin Through Hole Device, Body 21.59 x 16.13 mm; Series: MagJack; Contact Material: CopperAlloy; Datasheet URL: http://belfuse.com/pdfs/SI-60062-F.pdf; Width: 17.98mm; Length: 15.21mm; Mounting Technology: ThroughHole; Depth: 21.59mm; Orientation: Straight
R1#2 R2#2 R3#2 R4#2 R5-R7 R8#2 = CMP-2000-06960-1: Chip Resistor, 330 Ohm, +/- 1%, 125 mW, -55 to 155 degC, 0805 (2012 Metric), RoHS, Tape and Reel; Manufacturer: Yageo; Voltage Rating: 150V; Temperature Coefficient: 100PPM/C; Power Rating: 125mW(1/8W); Resistance: 330Ohms; Datasheet Version: Rev. 7, 05/2017; Termination Style: SMD/SMT; Case Code - mm: 2012; Package Description: 2-Pin Surface Mounted Device, Body 2 x 1.25 mm; Operating Temperature Range: -55Cto+155C; Case Code - in: 0805; Packaging: Reel; Tolerance: 1%; Package Reference: 0805; Mounting Technology: SurfaceMount; Product: ThickFilmResistorsGeneralPurpose; Series: RC; Manufacturer URL: http://www.yageo.com/; Datasheet URL: http://www.yageo.com/documents/recent/PYu-RC_Group_51_RoHS_L_7.pdf

## Sheet BATTERY-CONTROL.SchDoc
size B
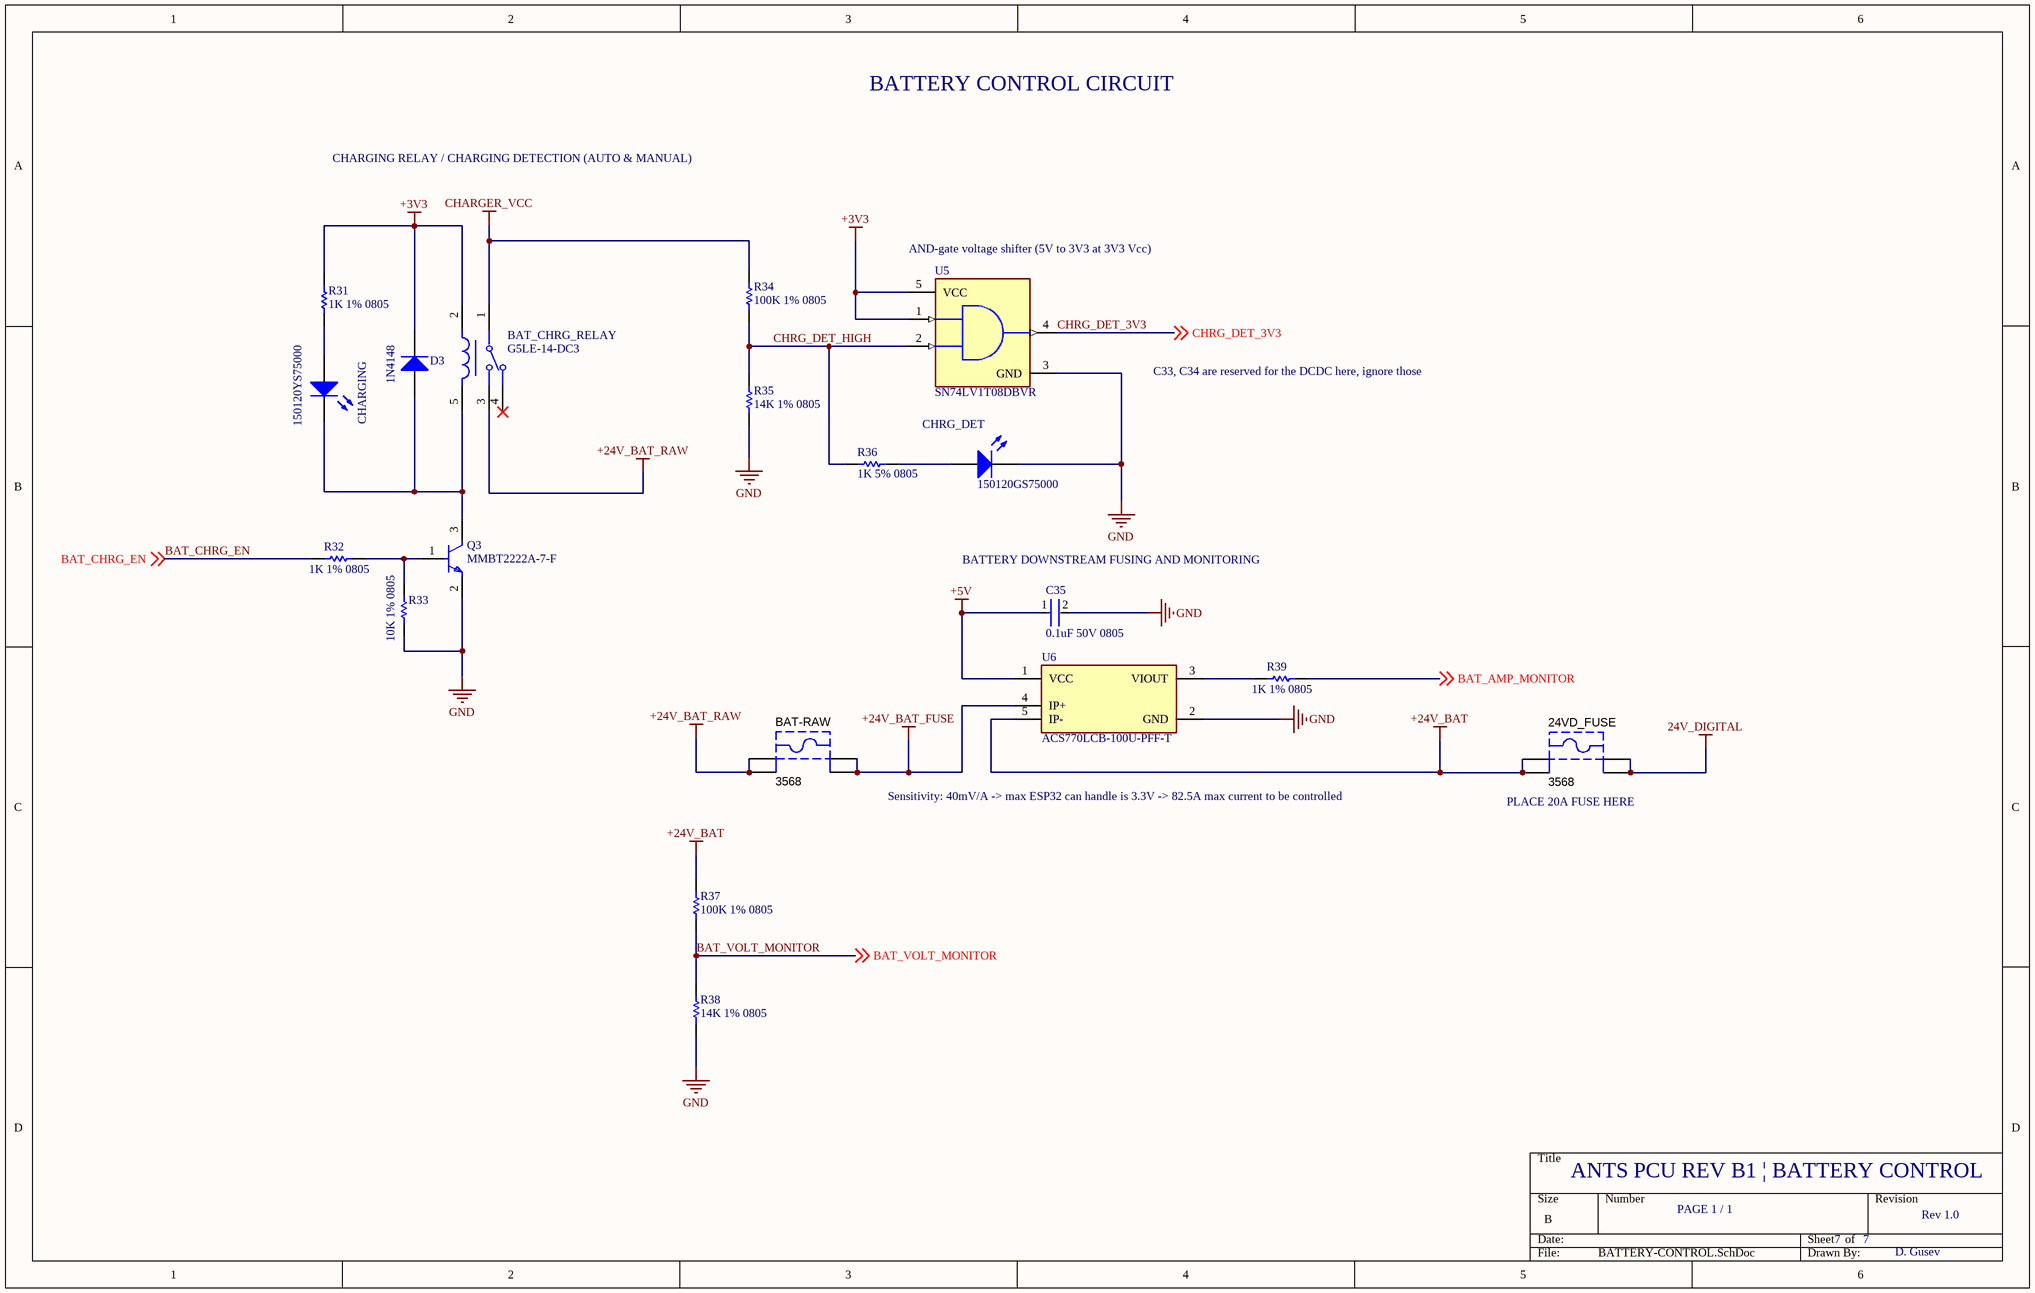
[diagram p4: BATTERY-CONTROL.SchDoc]

### Parts
24VD_FUSE  3568  [KSTN-3568_V]
BAT-RAW  3568  [KSTN-3568_V]
BAT_CHRG_RELAY  G5LE-14-DC3  [FP-G5LE-14-DC5-MFG]
C35  0.1uF 50V 0805  [FP-C0805C-DN-MFG]
CHARGING  150120YS75000  [1206_A]
CHRG_DET  150120GS75000  [1206_A]
D3  1N4148  [NXP-SOD27-2_V]
Q3  MMBT2222A-7-F  [FP-SOT23-IPC_A]
R31  1K 1% 0805  [RESC2013X60X35ML10T20]
R32  1K 1% 0805  [RESC2013X60X35ML10T20]
R33  10K 1% 0805  [RESC2013X60X35NL10T20]
R34  100K 1% 0805  [RESC2013X60X35ML10T20]
R35  14K 1% 0805  [RESC2013X60X35LL10T20]
R36  1K 5% 0805  [RESC2013X60X40ML20T25]
R37  100K 1% 0805  [RESC2013X60X35ML10T20]
R38  14K 1% 0805  [RESC2013X60X35LL10T20]
R39  1K 1% 0805  [RESC2013X60X35ML10T20]
U5  SN74LV1T08DBVR  [FP-DBV0005A-IPC_B]
U6  ACS770LCB-100U-PFF-T  [ACS770LCB-100U-PFF-T]

### Nets
24V_DIGITAL: 24VD_FUSE.3 24VD_FUSE.4  [project net +24V_DIGITAL]
+3V3: BAT_CHRG_RELAY.2 D3.2(K) R31.1 U5.1(A) U5.5(VCC)
+5V: C35.1 U6.1(VCC)
+24V_BAT: 24VD_FUSE.1 24VD_FUSE.2 R37.2 U6.5(IP-)
+24V_BAT_FUSE: BAT-RAW.1 BAT-RAW.2 U6.4(IP+)
+24V_BAT_RAW: BAT-RAW.3 BAT-RAW.4 BAT_CHRG_RELAY.3
CHARGER_VCC: BAT_CHRG_RELAY.1 R34.2
GND: C35.2 CHRG_DET.1(K) Q3.2(E) R33.1 R35.1 R38.1 U5.3(GND) U6.2(GND)
BAT_AMP_MONITOR: R39.2 ; off-sheet BAT_AMP_MONITOR
BAT_CHRG_EN: R32.1 ; off-sheet BAT_CHRG_EN
BAT_VOLT_MONITOR: R37.1 R38.2 ; off-sheet BAT_VOLT_MONITOR
CHRG_DET_3V3: U5.4(Y) ; off-sheet CHRG_DET_3V3
CHRG_DET_HIGH: R34.1 R35.2 R36.2 U5.2(B)
NetBAT_CHRG_RELAY_5: BAT_CHRG_RELAY.5 CHARGING.1(K) D3.1(A) Q3.3(C)
NetCHARGING_2: CHARGING.2(A) R31.2
NetCHRG_DET_2: CHRG_DET.2(A) R36.1
NetQ3_1: Q3.1(B) R32.2 R33.2
NetR39_1: R39.1 U6.3(VIOUT)

Not connected (* = marked no-connect by the designer): BAT_CHRG_RELAY 4*

### Notes on the sheet
- BATTERY CONTROL CIRCUIT
- CHARGING RELAY / CHARGING DETECTION (AUTO & MANUAL)
- (near U5) AND-gate voltage shifter (5V to 3V3 at 3V3 Vcc)
- C33, C34 are reserved for the DCDC here, ignore those
- (near C35) BATTERY DOWNSTREAM FUSING AND MONITORING
- Sensitivity: 40mV/A -> max ESP32 can handle is 3.3V -> 82.5A max current to be controlled
- (near 24VD_FUSE) PLACE 20A FUSE HERE
- ANTS PCU REV B1 | BATTERY CONTROL
- PAGE 1 / 1
- 7
- Rev 1.0
- D. Gusev

### Library data of the parts
24VD_FUSE BAT-RAW = CMP-2000-05464-1: Fuse Holder, 20 A, 500 V, -50 to 145 degC, 4-Pin THD, RoHS; Manufacturer: Keystone; Package Reference: 3568; Datasheet Version: 04/2013; Datasheet URL: https://datasheet.ciiva.com/16294/m60-2p40-16294706.pdf; Manufacturer URL: http://www.keyelco.com/; Mounting Technology: ThroughHole; Package Description: 4-Pin Through Hole Device, Body 16 x 6.73 mm, Pitch 9.9 mm
BAT_CHRG_RELAY = CMP-08822-000008-1: RELAY GEN PURPOSE SPDT 10A 5V; Manufacturer: Omron; Manufacturer Part Number: G5LE-14-DC5; Number Of Contacts: 1; Coil Type: Non-Latching; Coil Current: 79.4mA; Coil Power: 400mW; Coil Resistance: 63Ω; Standoff Height: 0.5mm; Throw Configuration: SPDT; Ambient Temperature Range Low: -25°C; Package: 0; Device Class L2: Relays; Temperature Range High: +85°C; ComponentLink2Description: Datasheet; Octopart: https://octopart.com/g5le-14-dc5-omron-28829; Coil Voltage: 5V; Lead Free: Yes; Digikey Description: RELAY GEN PURPOSE SPDT 10A 5V; Device Class L1: Electromechanical; Device Class L3: Power Relays; ComponentLink2URL: https://omronfs.omron.com/en_US/ecb/products/pdf/en-g5le.pdf; Temperature: -25°C to +85°C; Ambient Temperature Range High: +85°C; RoHS: TRUE; Automotive: No; Height: 19mm; Category: Relay; Mouser Description: General Purpose Relays Power PCB Relay SPDT Sealed 5VDC; Current Rating: 10A; Switching Current: 10A; Temperature Range Low: -25°C
C35 = CMP-2007-00279-2: as C2#1 on sheet USB-ESP32; Device Class L2: Capacitors; Temperature Range Low: -55°C; Voltage Rating: 50 V; Digikey Description: CAP CER 0.1UF 50V X7R 0805; Category: Cap; ComponentLink2Description: Datasheet; Octopart: https://octopart.com/c0805c104k5ractu-kemet-143926; RoHS: TRUE; ComponentLink2URL: https://content.kemet.com/datasheets/KEM_C1003_C0G_SMD.pdf; Temperature Characteristic: X7R; Temperature: -55°C to +125°C; Height: 0.88mm; Temperature Range High: +125°C; Device Class L1: Passive Components; Automotive: No; Lead Free: Yes; Ipc Land Pattern Name: CAPC200125X78; Device Class L3: Ceramic Capacitors; Mouser Description: Cap Ceramic 0.1uF 50V X7R 10% SMD 2.0 x 1.2 mm 125 C Paper T/R; Capacitance: 0.10 μF; Package: C0805C-DN
CHARGING = CMP-1426-00019-1: SMD mono-color Chip LED, WL-SMCW, Yellow; Manufacturer: Wuerth Elektronik; ComponentLink2URL: http://katalog.we-online.com/led/datasheet/150120YS75000.pdf; PartNumber: 150120YS75000; ComponentLink1URL: http://www.we-online.com; Color: Yellow; ComponentLink1Description: Manufacturer URL; PackageReference: 1206_A; ComponentLink2Description: Datasheet
CHRG_DET = CMP-1426-00014-1: as 3V3 on sheet ESP32-POWER; PackageReference: 1206_A; PartNumber: 150120GS75000; ComponentLink1Description: Manufacturer URL; ComponentLink2URL: http://katalog.we-online.com/led/datasheet/150120GS75000.pdf; ComponentLink2Description: Datasheet; Color: Green; ComponentLink1URL: http://www.we-online.com
D3 = CMP-0648-00002-1: High-speed Diode, 100 V, 450 mA, 2-Pin SOD27, RoHS; Manufacturer: NXP Semiconductors; Configuration: Single; IR (VR: 20 V)=25 nA; IFRM: 450 mA; IFSM: 4 A Max.; Trr: 4 ns Max.; Cd: 4 pF Max.; VR: 100 V Max.; VF (IF: 10 mA)=1 V; IF: 200 mA Max.; ComponentLink1Description: Manufacturer URL; RoHS: TRUE; ComponentLink1URL: http://www.nxp.com/; ComponentLink3Description: Package Specification; DatasheetVersion: Aug-04; ComponentLink2Description: Datasheet; PackageVersion: Aug-04; PackageReference: SOD27; ComponentLink3URL: http://www.nxp.com/documents/data_sheet/1N4148_1N4448.pdf; Mounting Technology: Through Hole; ComponentLink2URL: http://www.nxp.com/documents/data_sheet/1N4148_1N4448.pdf; PartNumber: 1N4148; PackageDescription: 2-Pin Hermetically Sealed Glass Package, Axial Leaded, Dia 1.85 mm, Body Length 4.25 mm, Lead Spread 25.4 mm
Q3 = CMP-12798-000050-1: TRANS NPN 40V 0.6A SMD SOT23-3; Number of Elements: 1; Frequency: 300MHz; Max Collector Current: 600mA; Collector Base Voltage (VCBO): 75V; Current: 1A; Element Configuration: Single; Power Dissipation: 350mW; hFE Min: 100; Collector Emitter Saturation Voltage: 1V; Max Power Dissipation: 300mW; Emitter Base Voltage (VEBO): 6V; Voltage: 40V; Collector Emitter Breakdown Voltage: 40V; Width: 1.4mm; Polarity: NPN; Termination: SMD/SMT; Max Operating Temperature: 150°C; Transition Frequency: 300MHz; Contact Plating: Tin; Mount: Surface Mount; Max Frequency: 300MHz; Case/Package: SOT-23; Gain Bandwidth Product: 300MHz; Lead Free: Lead Free; Collector Emitter Voltage (VCEO): 40V; Radiation Hardening: No; Voltage Rating (DC): 40V; Height: 1mm; Max Breakdown Voltage: 40V; Packaging: Tape and Reel; Length: 3.05mm; Min Operating Temperature: -55°C; Weight: 0.000282oz; Current Rating: 600mA; REACH SVHC: No SVHC; Package Quantity: 3000; Continuous Collector Current: 600mA; Number of Pins: 3
R31 R32 R39 = CMP-2100-03671-1: Chip Resistor, 1 KOhm, +/- 1%, 125 mW, -55 to 155 degC, 0805 (2012 Metric), RoHS, Tape and Reel; Manufacturer: Yageo; Temperature Coefficient: 100ppm/degreesC; Voltage Rating (DC): 150V; Max Power Dissipation: 125mW; Resistance: 1KOhm; Number of Pins: 2; Number of Terminations: 2; Datasheet URL: http://www.yageo.com/NewPortal/yageodocoutput?fileName=/pdf/R-Chip/PYu-RC_Group_51_RoHS_L_5.pdf; Length: 0.079inch; Package Description: 2-Pin Surface Mounted Device, Body 2 x 1.25 mm; Depth: 1.25mm; Height: 0.024inch; Military Standard: Not; Case/Package: 0805; Package Reference: 0805; RoHSCompliant: true; Lead Free: LeadFree; Packaging: TapeandReel; Package Quantity: 1; Datasheet Version: Rev. 5, 10/2016; Tolerance: 1%; Min Operating Temperature: -55degC; Voltage Rating: 150V; Composition: ThickFilm; Case Code (Imperial): 0805; Power Rating: 125mW; Width: 0.049inch; Case Code (Metric): 2012; Manufacturer URL: http://www.yageo.com/; Max Operating Temperature: 155degC; REACH SVHC: Unknown; Termination: SMD/SMT
R33 = CMP-1659-00013-4: Chip Resistor, 10 KOhm, +/- 1%, 0.125 W, -55 to 155 degC, 0805 (2012 Metric), RoHS, Tape and Reel; Manufacturer: Yageo; Voltage Rating: 150 V; Mount: Surface Mount; ComponentLink1Description: Manufacturer URL; ComponentLink2URL: http://www.yageo.com/documents/recent/PYu-RC_Group_51_RoHS_L_04.pdf; Pins: 2; Length: 2 mm; Min Operating Temperature: -55 degC; Height: 0.5 mm; Mounting Technology: Surface Mount; RoHSCompliant: true; REACH SVHC: No SVHC; ComponentLink1URL: http://www.yageo.com/; Max Operating Temperature: 155 degC; PackageReference: 0805; DatasheetVersion: Rev. 4, 02/2016; Package Quantity: 5000; Packaging: Tape and Reel; ComponentLink2Description: Datasheet; PackageDescription: 2-Pin Surface Mounted Device, Body 2 x 1.25 mm
R34 R37 = CMP-2100-03668-1: Chip Resistor, 100 KOhm, +/- 1%, 0.125 W, -55 to 155 degC, 0805 (2012 Metric), RoHS, Tape and Reel; Manufacturer: Yageo; Max Power Dissipation: 125mW; Voltage Rating: 150V; Temperature Coefficient: 100ppm/degreesC; Manufacturer URL: http://www.yageo.com/; Min Operating Temperature: -55degC; Lead Pitch: 0.4mm; Composition: ThickFilm; Case Code (Metric): 2012; Military Standard: Not; Package Description: 2-Pin Surface Mounted Device, Body 2 x 1.25 mm; REACH SVHC: Unknown; RoHSCompliant: true; Depth: 1.25mm; Number of Pins: 2; Lead Free: LeadFree; Resistance: 100KOhm; Datasheet URL: http://www.yageo.com/NewPortal/yageodocoutput?fileName=/pdf/R-Chip/PYu-RC_Group_51_RoHS_L_5.pdf; Max Operating Temperature: 155degC; Case/Package: 0805; Package Quantity: 1; Case Code (Imperial): 0805; Power Rating: 125mW; Width: 0.049inch; Package Reference: 0805; Height: 0.024inch; Termination: SMD/SMT; Tolerance: 1%; Datasheet Version: Rev. 5, 10/2016; Length: 2mm; Voltage Rating (DC): 150V; Number of Terminations: 2; Packaging: TapeandReel
R35 R38 = CMP-1013-00638-2: Part Number: RC0805FR-0714KL; Manufacturer: Yageo
R36 = CMP-2001-00590-1: as R1#1 on sheet USB-ESP32
U5 = CMP-0859-00119-4: IC GATE AND 1CH 2-INP SOT23-5; Quiescent Current: 1uA; Logic Function: AND GATE; Number of Inputs: 2; Number of Circuits: 1; Min Supply Voltage: 1.6V; High Level Output Current: -8mA; Max Supply Voltage: 5.5V; Low Level Output Current: 8mA; Propagation Delay: 7ns; Packaging: Tape and Reel; Number of Pins: 5; Min Operating Temperature: -40°C; Radiation Hardening: No; Package Quantity: 3000; Weight: 0.000557oz; Height: 1.45mm; RoHS Compliant: Yes; Length: 3.05mm; Number of Bits: 1; Width: 1.75mm; Number of Gates: 1; Max Operating Temperature: 125°C; Mount: Surface Mount; Case/Package: SOT-23-5; Lead Free: Lead Free; Number of Input Lines: 2
U6 = ACS770LCB-100U-PFF-T: SENSOR CURRENT HALL 100A DC; Min Input Voltage: 4.5V; Polarity: Unidirectional; Quiescent Current: 10mA; Bandwidth: 120kHz; Max Input Voltage: 5.5V; Sensitivity: 40mV/A; Accuracy: 0.6%; Response Time: 4.6us; Max Supply Current: 15mA; Linearity: 1%; Number of Channels: 1; Max Operating Temperature: 150°C; Package Quantity: 34; Min Operating Temperature: -40°C; Packaging: Rail/Tube; Number of Pins: 5; Width: 13mm; Height: 7mm; Current Sensing: 100A; Length: 14mm; Frequency: 120kHz; Mount: Through Hole

## Sheet POWER_RAIL_CTRL.SchDoc
size B
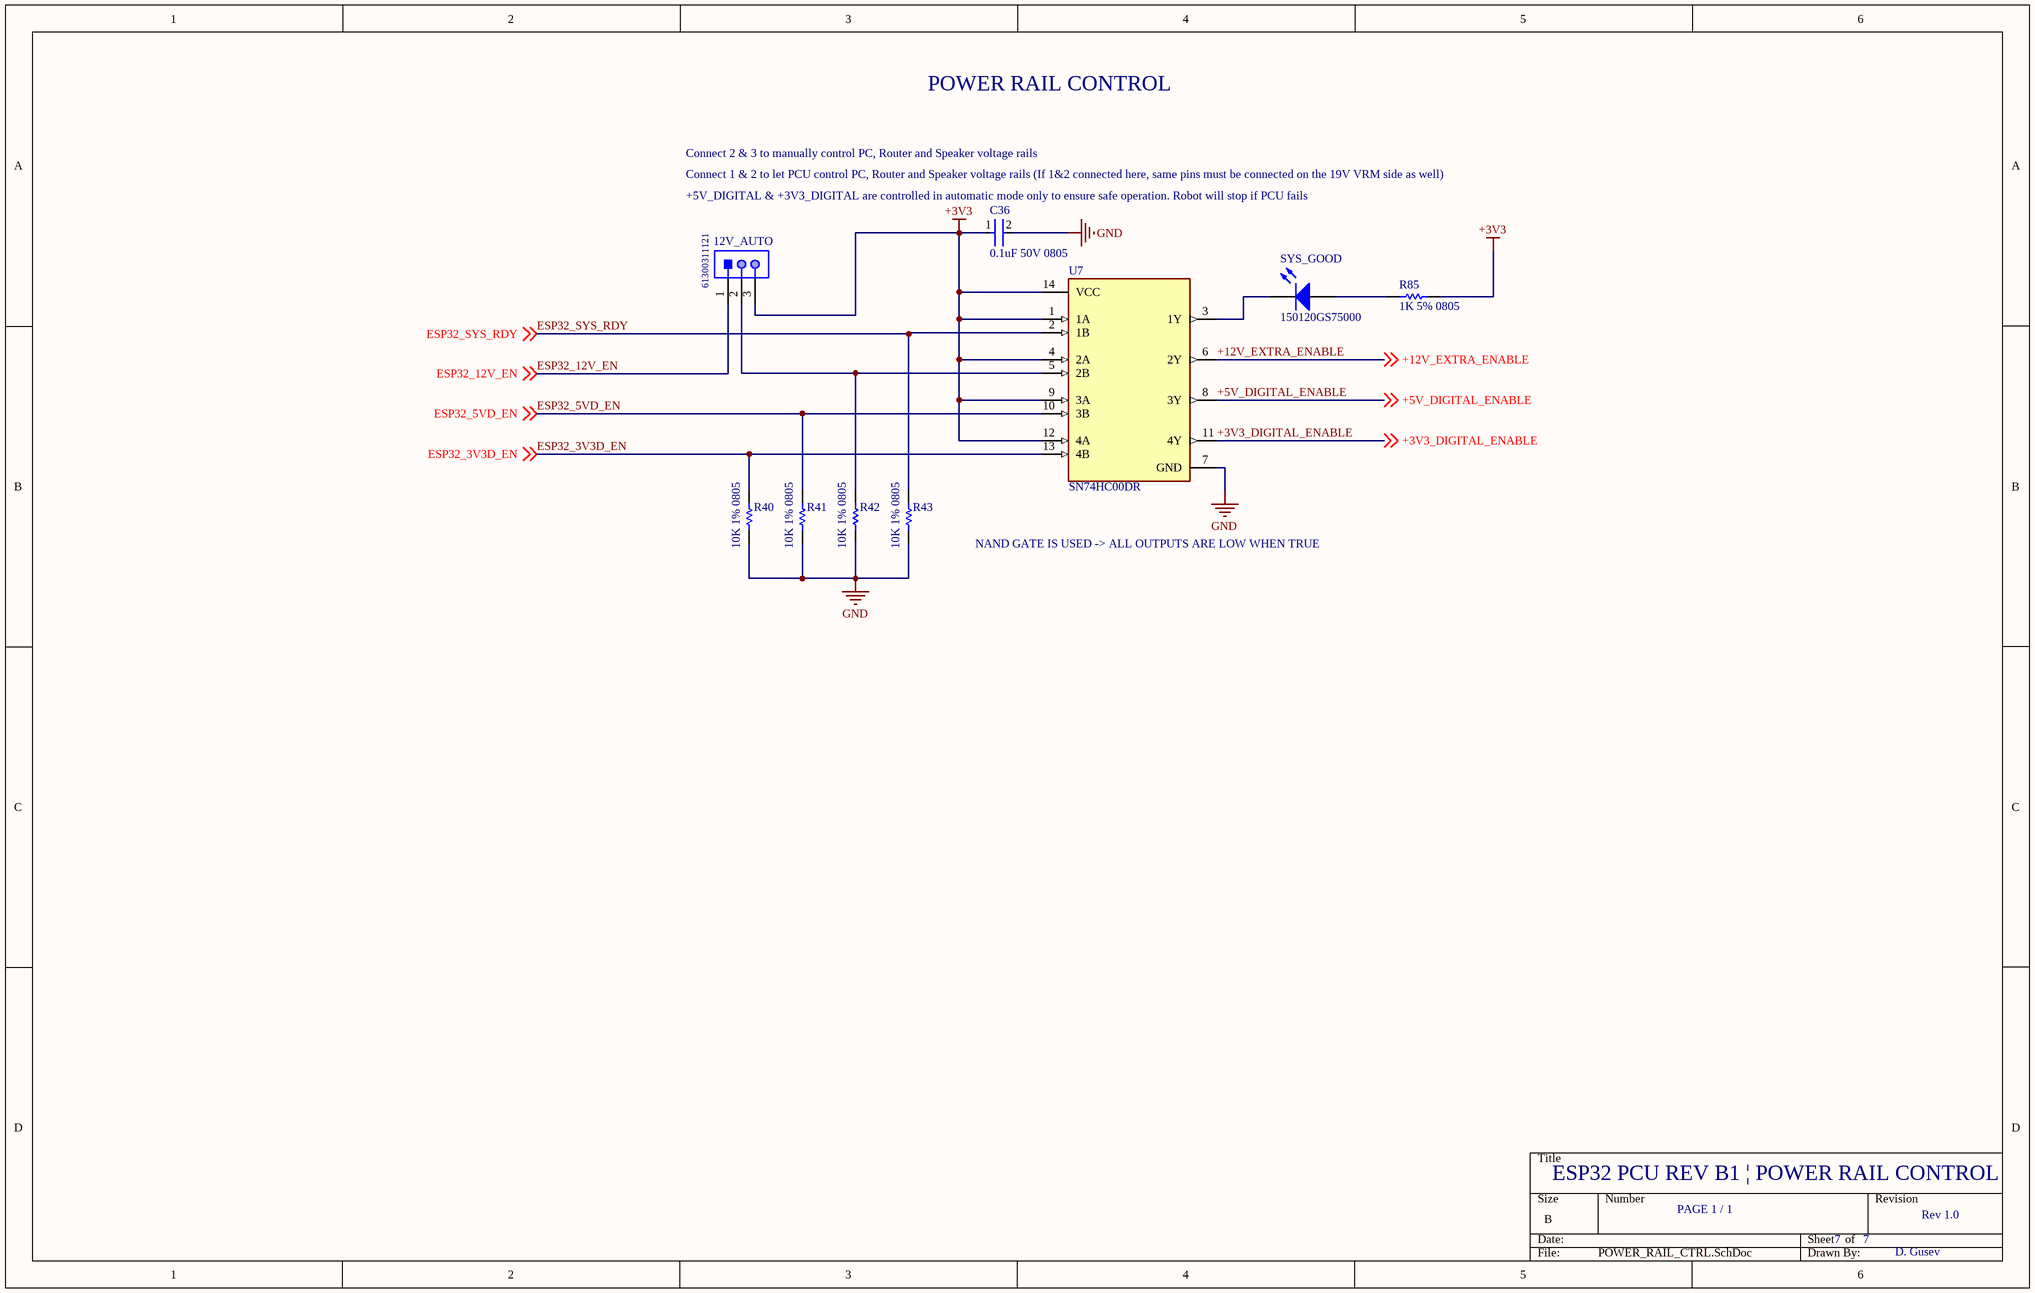
[diagram p5: POWER_RAIL_CTRL.SchDoc]

### Parts
12V_AUTO  61300311121  [61300311121]
C36  0.1uF 50V 0805  [FP-C0805C-DN-MFG]
R40  10K 1% 0805  [RESC2013X60X35NL10T20]
R41  10K 1% 0805  [RESC2013X60X35NL10T20]
R42  10K 1% 0805  [RESC2013X60X35NL10T20]
R43  10K 1% 0805  [RESC2013X60X35NL10T20]
R85  1K 5% 0805  [RESC2013X60X40ML20T25]
SYS_GOOD  150120GS75000  [1206_A]
U7  SN74HC00DR  [FP-D0014A-MFG]

### Nets
+3V3: 12V_AUTO.3 C36.1 R85.1 U7.1(1A) U7.4(2A) U7.9(3A) U7.12(4A) U7.14(VCC)
GND: C36.2 R40.1 R41.1 R42.1 R43.1 U7.7(GND)
+3V3_DIGITAL_ENABLE: U7.11(4Y) ; off-sheet +3V3_DIGITAL_ENABLE
+5V_DIGITAL_ENABLE: U7.8(3Y) ; off-sheet +5V_DIGITAL_ENABLE
+12V_EXTRA_ENABLE: U7.6(2Y) ; off-sheet +12V_EXTRA_ENABLE
ESP32_3V3D_EN: R40.2 U7.13(4B) ; off-sheet ESP32_3V3D_EN
ESP32_5VD_EN: R41.2 U7.10(3B) ; off-sheet ESP32_5VD_EN
ESP32_12V_EN: 12V_AUTO.1 ; off-sheet ESP32_12V_EN
ESP32_SYS_RDY: R43.2 U7.2(1B) ; off-sheet ESP32_SYS_RDY
Net12V_AUTO_2: 12V_AUTO.2 R42.2 U7.5(2B)
NetR85_2: R85.2 SYS_GOOD.2(A)
NetSYS_GOOD_1: SYS_GOOD.1(K) U7.3(1Y)

### Notes on the sheet
- POWER RAIL CONTROL
- Connect 2 & 3 to manually control PC, Router and Speaker voltage rails
- (near C36) Connect 1 & 2 to let PCU control PC, Router and Speaker voltage rails (If 1&2 connected here, same pins must be connected on the 19V VRM side as well)
- (near C36) +5V_DIGITAL & +3V3_DIGITAL are controlled in automatic mode only to ensure safe operation. Robot will stop if PCU fails
- NAND GATE IS USED -> ALL OUTPUTS ARE LOW WHEN TRUE
- ESP32 PCU REV B1 | POWER RAIL CONTROL
- PAGE 1 / 1
- 7
- Rev 1.0
- D. Gusev

### Library data of the parts
12V_AUTO = CMP-1502-01062-1: THT Vertical Pin Header WR-PHD, Pitch 2.54 mm, Single Row, 3 pins; Manufacturer: Wurth Elektronik; Withstanding Voltage: 500VAC; Working Voltage: 250VAC; Rated Current: 3A; Pitch: 2.54mm; Pin Number: 3; Gender: Male; Contact Resistance: 20mOhm; Package Reference: 61300311121; Manufacturer URL: http://www.we-online.de; Datasheet URL: https://katalog.we-online.de/em/datasheet/6130xx11121.pdf; Operating Temperature: -40to105degC; Part Number: 61300311121; Orientation: Vertical; Packaging: Bag; Row Number: Single; Mounting Technology: THT; Publisher: WurthElektronik
C36 = CMP-2007-00279-2: as C2#1 on sheet USB-ESP32; Device Class L2: Capacitors; Temperature Range Low: -55°C; Voltage Rating: 50 V; Digikey Description: CAP CER 0.1UF 50V X7R 0805; Category: Cap; ComponentLink2Description: Datasheet; Octopart: https://octopart.com/c0805c104k5ractu-kemet-143926; RoHS: TRUE; ComponentLink2URL: https://content.kemet.com/datasheets/KEM_C1003_C0G_SMD.pdf; Temperature Characteristic: X7R; Temperature: -55°C to +125°C; Height: 0.88mm; Temperature Range High: +125°C; Device Class L1: Passive Components; Automotive: No; Lead Free: Yes; Ipc Land Pattern Name: CAPC200125X78; Device Class L3: Ceramic Capacitors; Mouser Description: Cap Ceramic 0.1uF 50V X7R 10% SMD 2.0 x 1.2 mm 125 C Paper T/R; Capacitance: 0.10 μF; Package: C0805C-DN
R40-R43 = CMP-1659-00013-4: as R33 on sheet BATTERY-CONTROL; Mount: Surface Mount; ComponentLink1Description: Manufacturer URL; ComponentLink2URL: http://www.yageo.com/documents/recent/PYu-RC_Group_51_RoHS_L_04.pdf; Pins: 2; Length: 2 mm; Min Operating Temperature: -55 degC; Height: 0.5 mm; Mounting Technology: Surface Mount; RoHSCompliant: true; REACH SVHC: No SVHC; ComponentLink1URL: http://www.yageo.com/; Max Operating Temperature: 155 degC; PackageReference: 0805; DatasheetVersion: Rev. 4, 02/2016; Package Quantity: 5000; Packaging: Tape and Reel; ComponentLink2Description: Datasheet; PackageDescription: 2-Pin Surface Mounted Device, Body 2 x 1.25 mm
R85 = CMP-2001-00590-1: as R1#1 on sheet USB-ESP32
SYS_GOOD = CMP-1426-00014-1: as 3V3 on sheet ESP32-POWER; PackageReference: 1206_A; PartNumber: 150120GS75000; ComponentLink1Description: Manufacturer URL; ComponentLink2URL: http://katalog.we-online.com/led/datasheet/150120GS75000.pdf; ComponentLink2Description: Datasheet; Color: Green; ComponentLink1URL: http://www.we-online.com
U7 = CMP-1622-00008-3: IC GATE NAND 4CH 2-INP 14SOIC; Number of Bits: 4; Number of Input Lines: 2; Max Supply Voltage: 6V; Operating Supply Voltage: 5V; Min Supply Voltage: 2V; Logic Function: NAND GATE; Low Level Output Current: 5.2mA; Turn-On Delay Time: 23ns; Number of Outputs: 1; Output Current: 25mA; Quiescent Current: 2uA; Schmitt Trigger Input: No; High Level Output Current: -5.2mA; Propagation Delay: 15ns; Radiation Hardening: No; Contact Plating: Tin; Packaging: Tape and Reel; Number of Pins: 14; Max Operating Temperature: 85°C; Mount: Surface Mount; REACH SVHC: No SVHC; Case/Package: SOIC; Package Quantity: 1; Length: 8.65mm; Number of Circuits: 4; Number of Gates: 4; Height: 1.58mm; Min Operating Temperature: -40°C; Weight: 0.004318oz; Number of Output Lines: 1; RoHS Compliant: Yes; Width: 3.91mm; Lead Free: Lead Free; Number of Inputs: 2; Number of Elements: 4